# Altium project XMS0004.PrjPcb (part 1 of 3)
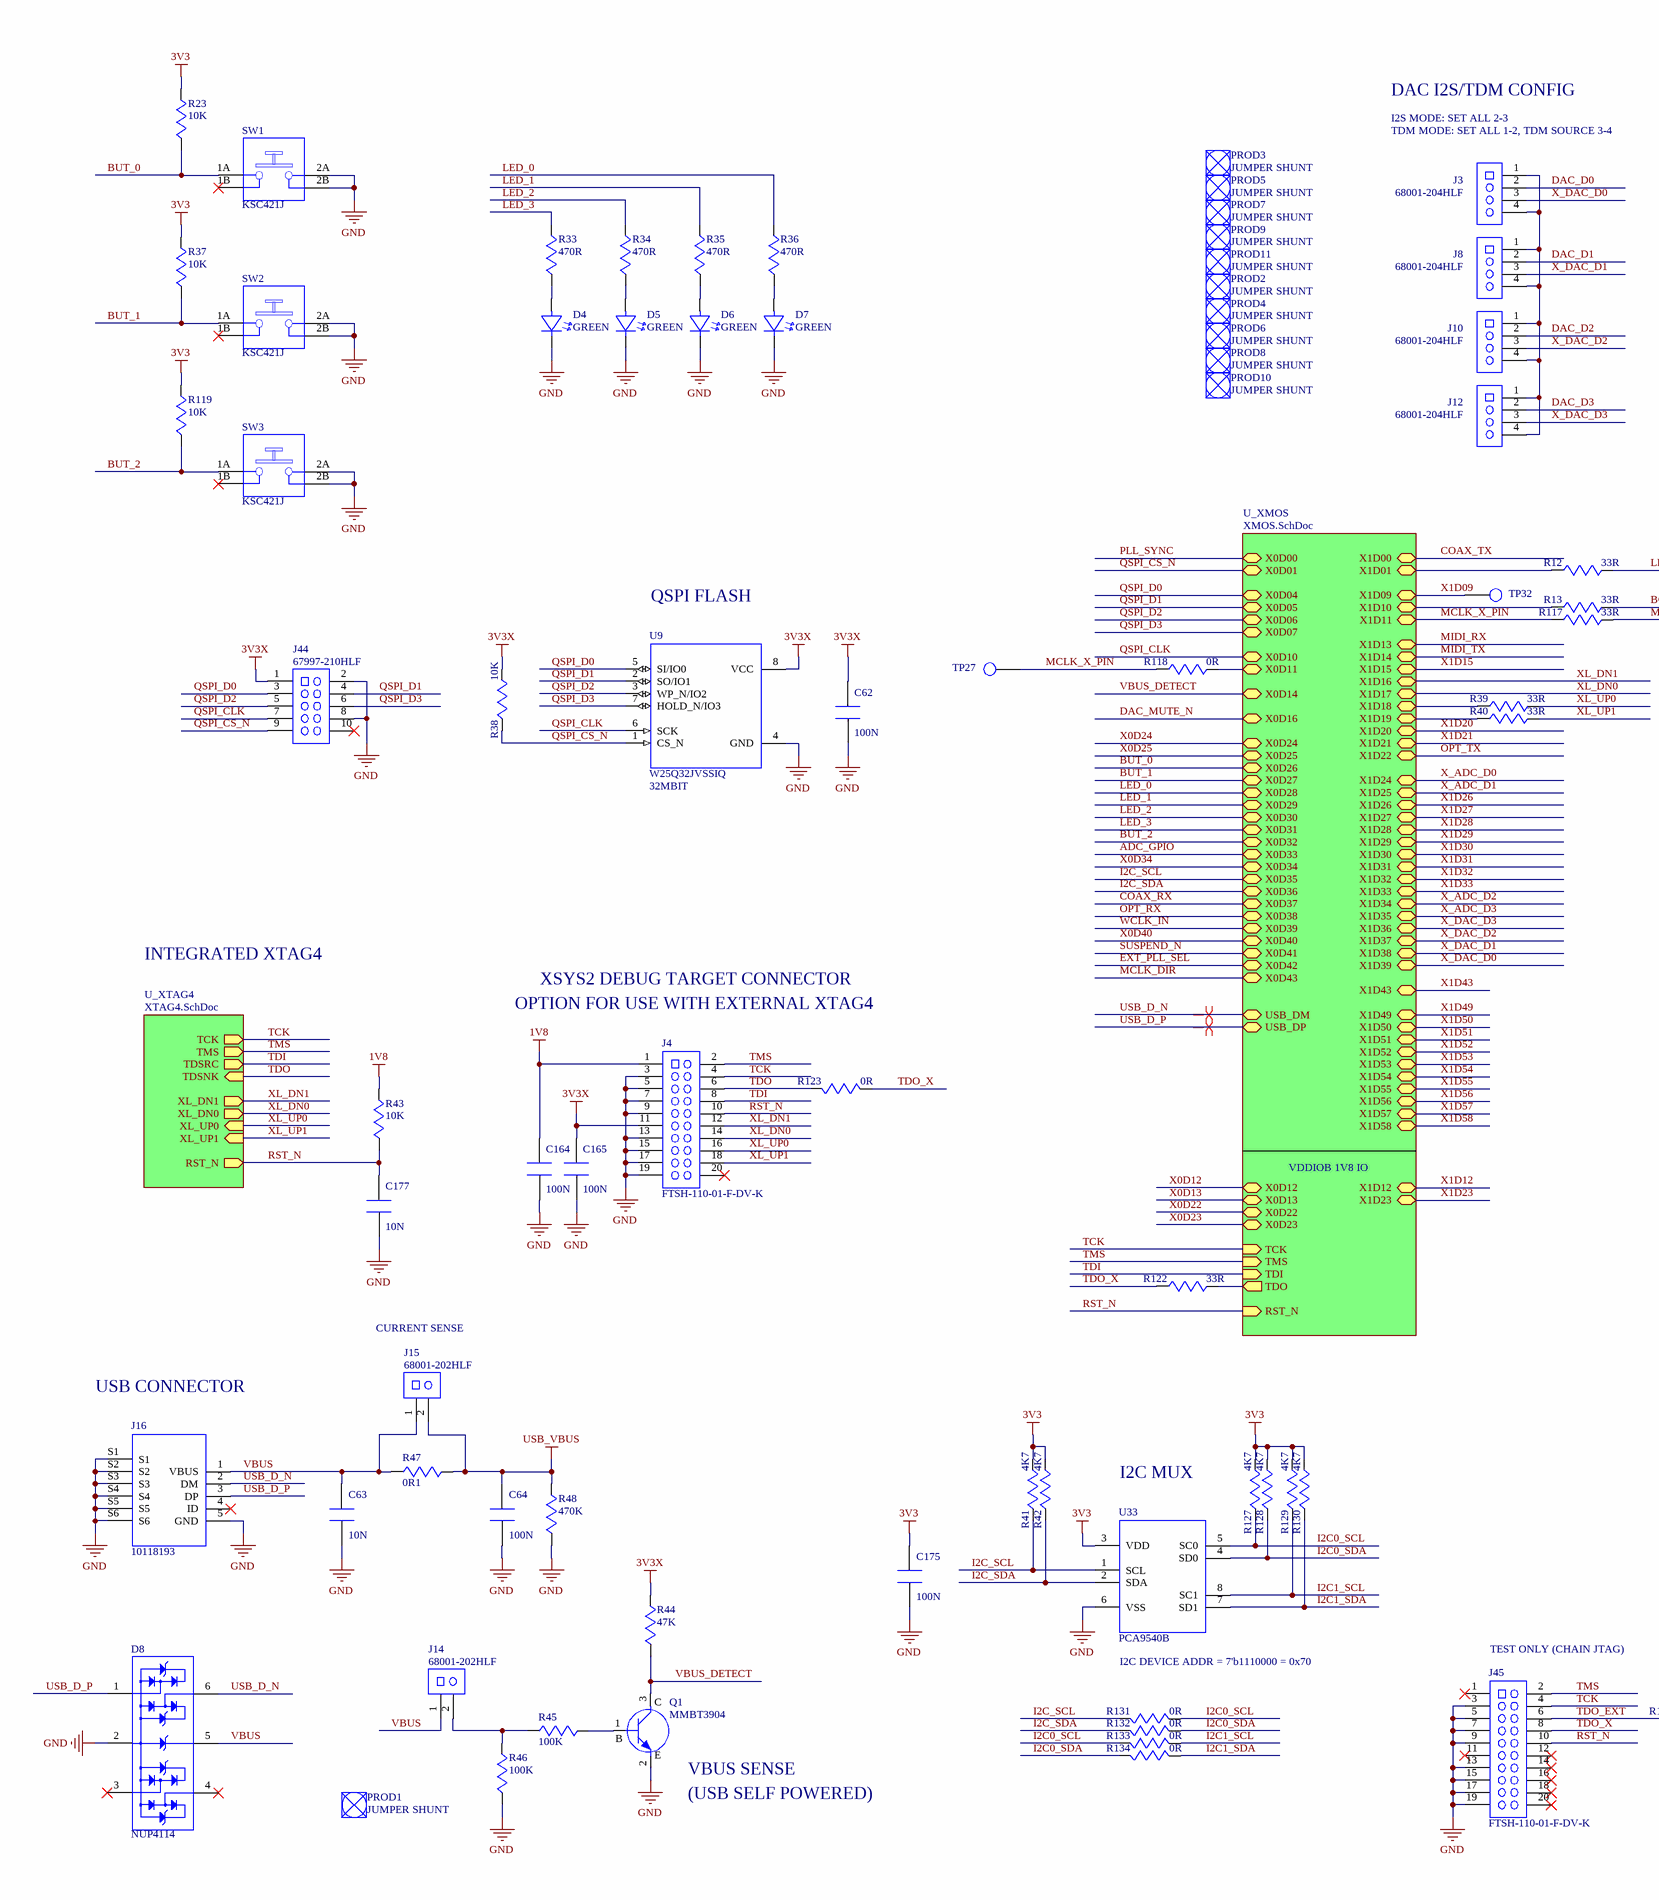
[diagram p0: Top Level.SchDoc, left]
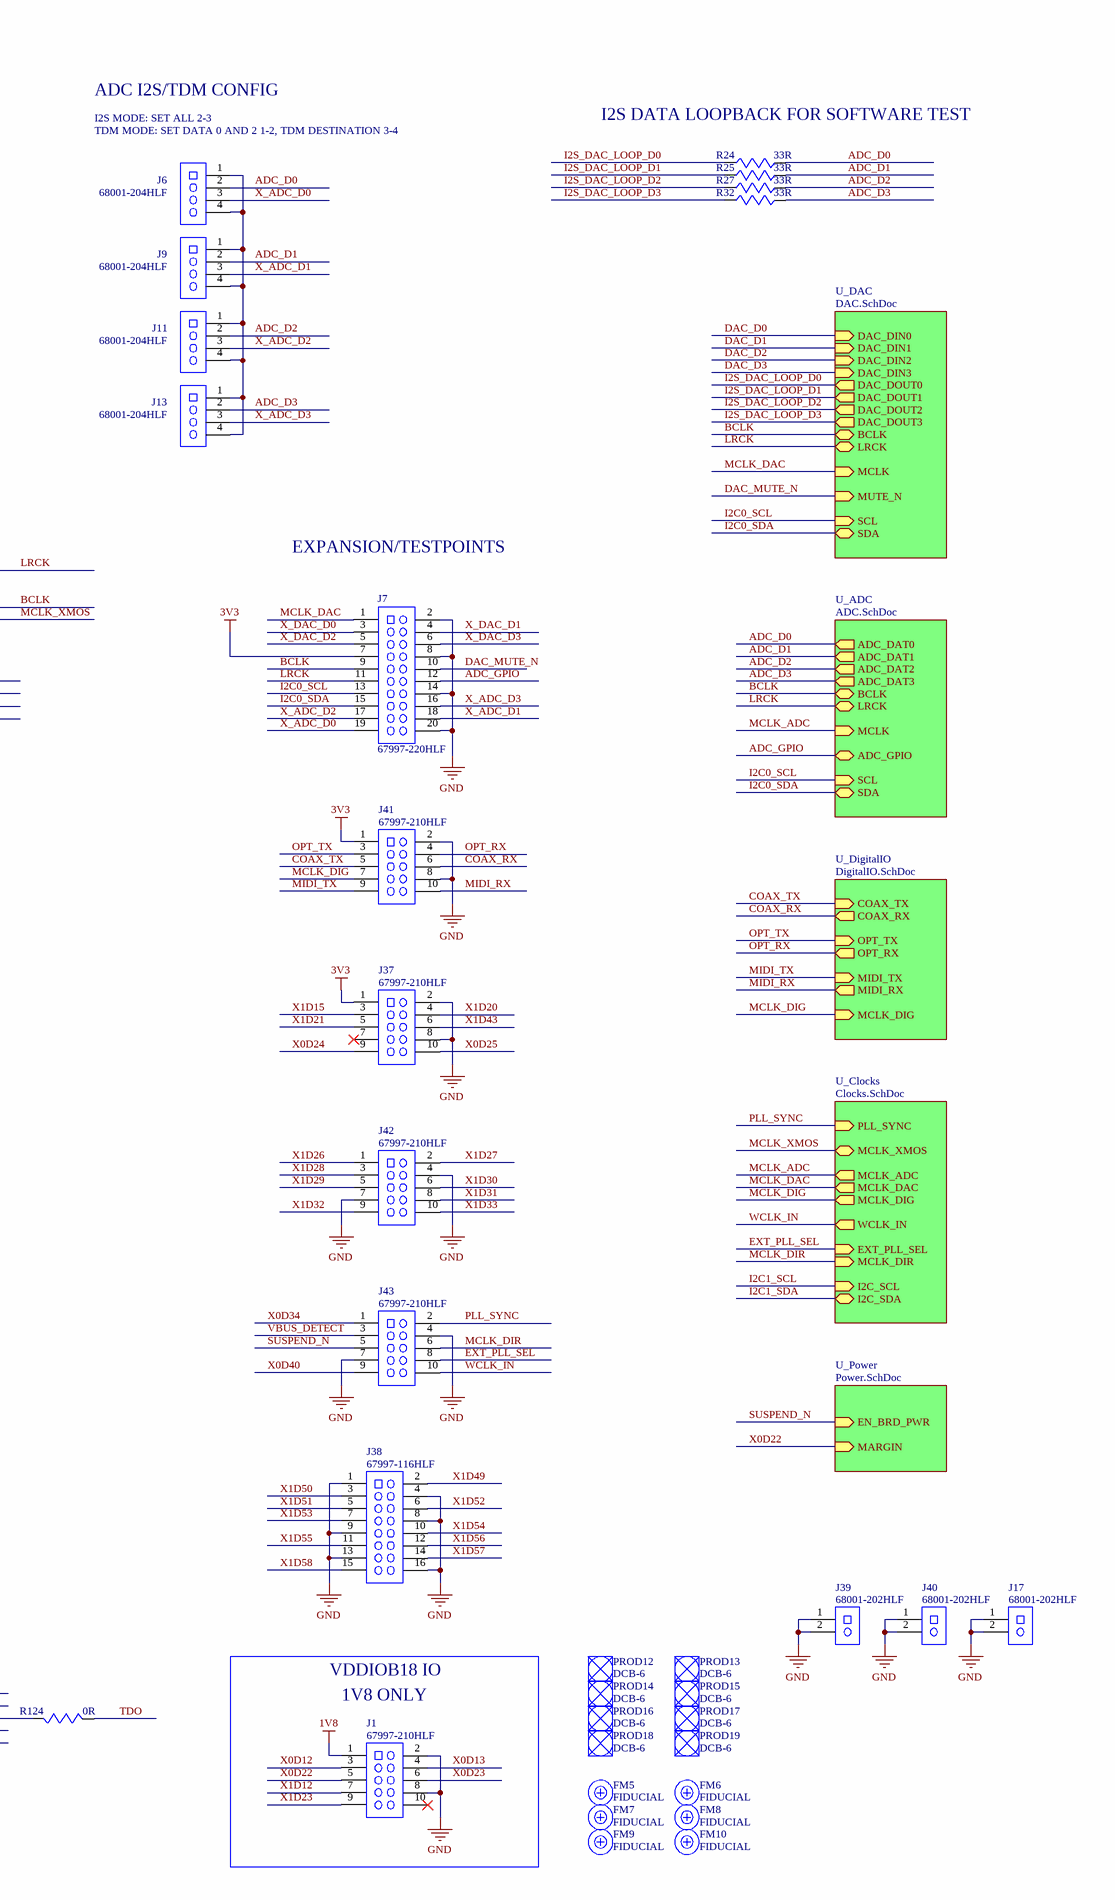
[diagram p1: Top Level.SchDoc, right]
PCB_revision: 1V1
8 sheets, 513 parts. Net scope: hierarchical (ports join the sheet entries above them; power ports are global).
Board file: XMS0004.PcbDoc
Sheets:
  Top Level.SchDoc
    U_XMOS = XMOS.SchDoc
    U_Power = Power.SchDoc
    U_ADC = ADC.SchDoc
    U_DAC = DAC.SchDoc
    U_XTAG4 = XTAG4.SchDoc
    U_DigitalIO = DigitalIO.SchDoc
    U_Clocks = Clocks.SchDoc

## Sheet Top Level.SchDoc: xcore.ai Multi Channel Audio
size 584 x 408 mm; DocumentNumber: 1; Revision: 1V1; SheetNumber: 1; SheetTotal: 8

### Parts
C62  100N  [CAPC1005X55N]
C63  10N  [CAPC1005X55N]
C64  100N  [CAPC1005X55N]
C164  100N  [CAPC1005X55N]
C165  100N  [CAPC1005X55N]
C175  100N  [CAPC1005X55N]
C177  10N  [CAPC1005X55N]
D4  Colour: GREEN  [LEDC1608X85N]  (hidden comment: APT1608)
D5  Colour: GREEN  [LEDC1608X85N]  (hidden comment: APT1608)
D6  Colour: GREEN  [LEDC1608X85N]  (hidden comment: APT1608)
D7  Colour: GREEN  [LEDC1608X85N]  (hidden comment: APT1608)
D8  NUP4114  [SOT65P210X110-6N]
FM5  FIDUCIAL  [FIDUCIAL_10_20]  (no BOM)
FM6  FIDUCIAL  [FIDUCIAL_10_20]  (no BOM)
FM7  FIDUCIAL  [FIDUCIAL_10_20]  (no BOM)
FM8  FIDUCIAL  [FIDUCIAL_10_20]  (no BOM)
FM9  FIDUCIAL  [FIDUCIAL_10_20]  (no BOM)
FM10  FIDUCIAL  [FIDUCIAL_10_20]  (no BOM)
J1  67997-210HLF  [HDR_FCI_67997_X10]
J3  68001-204HLF  [HDR_FCI_68001_204]
J4  FTSH-110-01-F-DV-K  [CON_SAMTEC_FTSH_110_01_X_DV_K]
J6  68001-204HLF  [HDR_FCI_68001_204]
J7  67997-220HLF  [HDR_FCI_67997_220]
J8  68001-204HLF  [HDR_FCI_68001_204]
J9  68001-204HLF  [HDR_FCI_68001_204]
J10  68001-204HLF  [HDR_FCI_68001_204]
J11  68001-204HLF  [HDR_FCI_68001_204]
J12  68001-204HLF  [HDR_FCI_68001_204]
J13  68001-204HLF  [HDR_FCI_68001_204]
J14  68001-202HLF  [HDR_FCI_68001_202]
J15  68001-202HLF  [HDR_FCI_68001_202]
J16  10118193  [CON_FCI_10118193]
J17  68001-202HLF  [HDR_FCI_68001_202]
J37  67997-210HLF  [HDR_FCI_67997_X10]
J38  67997-116HLF  [HDR_FCI_67997_116]
J39  68001-202HLF  [HDR_FCI_68001_202]
J40  68001-202HLF  [HDR_FCI_68001_202]
J41  67997-210HLF  [HDR_FCI_67997_X10]
J42  67997-210HLF  [HDR_FCI_67997_X10]
J43  67997-210HLF  [HDR_FCI_67997_X10]
J44  67997-210HLF  [HDR_FCI_67997_X10]
J45  FTSH-110-01-F-DV-K  [CON_SAMTEC_FTSH_110_01_X_DV_K]
PROD1  JUMPER SHUNT  (mechanical)
PROD2  JUMPER SHUNT  (mechanical)
PROD3  JUMPER SHUNT  (mechanical)
PROD4  JUMPER SHUNT  (mechanical)
PROD5  JUMPER SHUNT  (mechanical)
PROD6  JUMPER SHUNT  (mechanical)
PROD7  JUMPER SHUNT  (mechanical)
PROD8  JUMPER SHUNT  (mechanical)
PROD9  JUMPER SHUNT  (mechanical)
PROD10  JUMPER SHUNT  (mechanical)
PROD11  JUMPER SHUNT  (mechanical)
PROD12  DCB-6  (mechanical)
PROD13  DCB-6  (mechanical)
PROD14  DCB-6  (mechanical)
PROD15  DCB-6  (mechanical)
PROD16  DCB-6  (mechanical)
PROD17  DCB-6  (mechanical)
PROD18  DCB-6  (mechanical)
PROD19  DCB-6  (mechanical)
Q1  MMBT3904  [SOT95P235X115-3N]
R12  33R  [RESC1608X55N]
R13  33R  [RESC1608X55N]
R23  10K  [RESC1608X55N]
R24  33R  [RESC1608X55N]
R25  33R  [RESC1608X55N]
R27  33R  [RESC1608X55N]
R32  33R  [RESC1608X55N]
R33  470R  [RESC1608X55N]
R34  470R  [RESC1608X55N]
R35  470R  [RESC1608X55N]
R36  470R  [RESC1608X55N]
R37  10K  [RESC1608X55N]
R38  10K  [RESC1608X55N]
R39  33R  [RESC1608X55N]
R40  33R  [RESC1608X55N]
R41  4K7  [RESC1608X55N]
R42  4K7  [RESC1608X55N]
R43  10K  [RESC1608X55N]
R44  47K  [RESC1608X55N]
R45  100K  [RESC1608X55N]
R46  100K  [RESC1608X55N]
R47  0R1  [RESC2012X60N]
R48  470K  [RESC1608X55N]
R117  33R  [RESC1608X55N]
R118  0R  [RESC1608X55N]
R119  10K  [RESC1608X55N]
R122  33R  [RESC1608X55N]
R123  0R  [RESC1608X55N]
R124  0R  [RESC1608X55N]
R127  4K7  [RESC1608X55N]
R128  4K7  [RESC1608X55N]
R129  4K7  [RESC1608X55N]
R130  4K7  [RESC1608X55N]
R131  0R  [RESC1608X55N]
R132  0R  [RESC1608X55N]
R133  0R  [RESC1608X55N]
R134  0R  [RESC1608X55N]
SW1  KSC421J  [SW_CK_KSC4_JBEND]
SW2  KSC421J  [SW_CK_KSC4_JBEND]
SW3  KSC421J  [SW_CK_KSC4_JBEND]
TP27  TESTPOINT  [TESTPOINT_SMD_1MM]  (value not drawn)  (no BOM)
TP32  TESTPOINT  [TESTPOINT_SMD_0.9MM_L]  (value not drawn)  (no BOM)
U9  W25Q32JVSSIQ  Memory Size: 32MBIT  [SOIC127P790X220-8N]
U33  PCA9540B  [SOP65P490X110-8N]

### Sub-sheets
U_ADC = ADC.SchDoc: MCLK (in), BCLK (bidir), LRCK (bidir), SCL (in), SDA (bidir), ADC_DAT0 (out), ADC_DAT2 (out), ADC_DAT1 (out), ADC_DAT3 (out), ADC_GPIO (bidir)
U_Clocks = Clocks.SchDoc: PLL_SYNC (in), I2C_SDA (bidir), I2C_SCL (in), MCLK_XMOS (bidir), MCLK_ADC (out), MCLK_DAC (out), WCLK_IN (out), MCLK_DIG (out), EXT_PLL_SEL (in), MCLK_DIR (in)
U_DAC = DAC.SchDoc: MCLK (in), BCLK (bidir), LRCK (bidir), SCL (in), SDA (bidir), DAC_DOUT0 (out), DAC_DIN3 (in), DAC_DIN1 (in), DAC_DIN2 (in), DAC_DIN0 (in), MUTE_N (in), DAC_DOUT1 (out), DAC_DOUT3 (out), DAC_DOUT2 (out)
U_DigitalIO = DigitalIO.SchDoc: MIDI_RX (out), MIDI_TX (in), COAX_TX (in), COAX_RX (out), OPT_RX (out), OPT_TX (in), MCLK_DIG (in)
U_Power = Power.SchDoc: EN_BRD_PWR (in), MARGIN (in)
U_XMOS = XMOS.SchDoc: RST_N (in), TDO (out), TDI (in), TMS (in), TCK (in), X0D10 (bidir), X0D07 (bidir), X0D06 (bidir), X0D05 (bidir), X0D04 (bidir), X0D01 (bidir), USB_DM (bidir), USB_DP (bidir), X1D58 (bidir), X1D57 (bidir), X1D56 (bidir), X1D55 (bidir), X1D54 (bidir), X1D53 (bidir), X1D52 (bidir), X1D51 (bidir), X1D50 (bidir), X1D49 (bidir), X1D22 (bidir), X1D21 (bidir), X1D20 (bidir), X1D19 (bidir), X1D18 (bidir), X1D17 (bidir), X1D16 (bidir), X1D15 (bidir), X1D14 (bidir), X1D13 (bidir), X0D38 (bidir), X0D37 (bidir), X0D36 (bidir), X0D35 (bidir), X0D29 (bidir), X0D28 (bidir), X0D27 (bidir), X0D26 (bidir), X0D25 (bidir), X0D24 (bidir), X1D43 (bidir), X1D35 (bidir), X1D34 (bidir), X1D33 (bidir), X1D32 (bidir), X1D31 (bidir), X1D30 (bidir), X1D29 (bidir), X1D36 (bidir), X1D39 (bidir), X1D11 (bidir), X1D10 (bidir), X0D33 (bidir), X0D32 (bidir), X0D40 (bidir), X0D41 (bidir), X0D42 (bidir), X0D43 (bidir), X1D24 (bidir), X1D25 (bidir), X1D26 (bidir), X1D27 (bidir), X1D28 (bidir), X0D39 (bidir), X1D01 (bidir), X1D09 (bidir), X0D30 (bidir), X0D31 (bidir), X1D37 (bidir), X1D38 (bidir), X0D34 (bidir), X1D00 (bidir), X0D11 (bidir), X0D14 (bidir), X0D16 (bidir), X0D00 (bidir), X0D22 (bidir), X1D12 (bidir), X1D23 (bidir), X0D23 (bidir), X0D13 (bidir), X0D12 (bidir)
U_XTAG4 = XTAG4.SchDoc: RST_N (out), XL_UP0 (in), XL_UP1 (in), XL_DN0 (out), XL_DN1 (out), TMS (out), TCK (out), TDSRC (out), TDSNK (in)

### Nets
1V8: C164.1 J1.1 J4.1 R43.2
3V3: C175.1 J7.7 J37.1 J41.1 R23.2 R37.2 R41.2 R42.2 R119.2 R127.2 R128.2 R129.2 R130.2 U33.3(VDD)
3V3X: C62.1 C165.1 J4.11 J44.1 R38.2 R44.2 U9.8(VCC)
GND: C62.2 C63.2 C64.2 C164.2 C165.2 C175.2 C177.2 D4.1(K) D5.1(K) D6.1(K) D7.1(K) D8.2 J1.2 J1.8 J4.3 J4.5 J4.7 J4.9 J4.13 J4.15 J4.17 J4.19 J7.2 J7.8 J7.14 J7.20 J16.5(GND) J16.S1 J16.S2 J16.S3 J16.S4 J16.S5 J16.S6 J17.1 J17.2 J37.2 J37.8 J38.1 J38.4 J38.8 J38.9 J38.13 J38.16 J39.1 J39.2 J40.1 J40.2 J41.2 J41.8 J42.4 J42.7 J43.4 J43.7 J44.2 J44.8 J45.3 J45.5 J45.7 J45.9 J45.13 J45.15 J45.17 J45.19 Q1.2(E1) R46.1 R48.1 SW1.2A SW1.2B SW2.2A SW2.2B SW3.2A SW3.2B U9.4(GND) U33.6(VSS)
USB_VBUS: C64.1 J15.2 R47.2 R48.2
ADC_D0: J6.2 R24.2 ; sheet U_ADC/ADC_DAT0
ADC_D1: J9.2 R25.2 ; sheet U_ADC/ADC_DAT1
ADC_D2: J11.2 R27.2 ; sheet U_ADC/ADC_DAT2
ADC_D3: J13.2 R32.2 ; sheet U_ADC/ADC_DAT3
ADC_GPIO: J7.12 ; sheet U_XMOS/X0D33, sheet U_ADC/ADC_GPIO
BCLK: J7.9 R13.2 ; sheet U_ADC/BCLK, sheet U_DAC/BCLK
BUT_0: R23.1 SW1.1A ; sheet U_XMOS/X0D26
BUT_1: R37.1 SW2.1A ; sheet U_XMOS/X0D27
BUT_2: R119.1 SW3.1A ; sheet U_XMOS/X0D32
COAX_RX: J41.6 ; sheet U_XMOS/X0D37, sheet U_DigitalIO/COAX_RX
COAX_TX: J41.5 ; sheet U_XMOS/X1D00, sheet U_DigitalIO/COAX_TX
DAC_D0: J3.2 ; sheet U_DAC/DAC_DIN0
DAC_D1: J8.2 ; sheet U_DAC/DAC_DIN1
DAC_D2: J10.2 ; sheet U_DAC/DAC_DIN2
DAC_D3: J12.2 ; sheet U_DAC/DAC_DIN3
DAC_MUTE_N: J7.10 ; sheet U_XMOS/X0D16, sheet U_DAC/MUTE_N
EXT_PLL_SEL: J43.8 ; sheet U_XMOS/X0D42, sheet U_Clocks/EXT_PLL_SEL
I2C0_SCL: J7.13 R127.1 R131.1 R133.2 U33.5(SC0) ; sheet U_ADC/SCL, sheet U_DAC/SCL
I2C0_SDA: J7.15 R128.1 R132.1 R134.2 U33.4(SD0) ; sheet U_ADC/SDA, sheet U_DAC/SDA
I2C1_SCL: R129.1 R133.1 U33.8(SC1) ; sheet U_Clocks/I2C_SCL
I2C1_SDA: R130.1 R134.1 U33.7(SD1) ; sheet U_Clocks/I2C_SDA
I2C_SCL: R41.1 R131.2 U33.1(SCL) ; sheet U_XMOS/X0D35
I2C_SDA: R42.1 R132.2 U33.2(SDA) ; sheet U_XMOS/X0D36
I2S_DAC_LOOP_D0: R24.1 ; sheet U_DAC/DAC_DOUT0
I2S_DAC_LOOP_D1: R25.1 ; sheet U_DAC/DAC_DOUT1
I2S_DAC_LOOP_D2: R27.1 ; sheet U_DAC/DAC_DOUT2
I2S_DAC_LOOP_D3: R32.1 ; sheet U_DAC/DAC_DOUT3
LED_0: R36.2 ; sheet U_XMOS/X0D28
LED_1: R35.2 ; sheet U_XMOS/X0D29
LED_2: R34.2 ; sheet U_XMOS/X0D30
LED_3: R33.2 ; sheet U_XMOS/X0D31
LRCK: J7.11 R12.2 ; sheet U_ADC/LRCK, sheet U_DAC/LRCK
MCLK_ADC: sheet U_ADC/MCLK, sheet U_Clocks/MCLK_ADC
MCLK_DAC: J7.1 ; sheet U_DAC/MCLK, sheet U_Clocks/MCLK_DAC
MCLK_DIG: J41.7 ; sheet U_DigitalIO/MCLK_DIG, sheet U_Clocks/MCLK_DIG
MCLK_DIR: J43.6 ; sheet U_XMOS/X0D43, sheet U_Clocks/MCLK_DIR
MCLK_X_PIN: R117.1 R118.1 TP27.1 ; sheet U_XMOS/X1D11
MCLK_XMOS: R117.2 ; sheet U_Clocks/MCLK_XMOS
MIDI_RX: J41.10 ; sheet U_XMOS/X1D13, sheet U_DigitalIO/MIDI_RX
MIDI_TX: J41.9 ; sheet U_XMOS/X1D14, sheet U_DigitalIO/MIDI_TX
OPT_RX: J41.4 ; sheet U_XMOS/X0D38, sheet U_DigitalIO/OPT_RX
OPT_TX: J41.3 ; sheet U_XMOS/X1D22, sheet U_DigitalIO/OPT_TX
PLL_SYNC: J43.2 ; sheet U_XMOS/X0D00, sheet U_Clocks/PLL_SYNC
QSPI_CLK: J44.7 U9.6(SCK) ; sheet U_XMOS/X0D10
QSPI_CS_N: J44.9 R38.1 U9.1(CS_N) ; sheet U_XMOS/X0D01
QSPI_D0: J44.3 U9.5(SI/IO0) ; sheet U_XMOS/X0D04
QSPI_D1: J44.4 U9.2(SO/IO1) ; sheet U_XMOS/X0D05
QSPI_D2: J44.5 U9.3(WP_N/IO2) ; sheet U_XMOS/X0D06
QSPI_D3: J44.6 U9.7(HOLD_N/IO3) ; sheet U_XMOS/X0D07
RST_N: C177.1 J4.10 J45.10 R43.1 ; sheet U_XMOS/RST_N, sheet U_XTAG4/RST_N
SUSPEND_N: J43.5 ; sheet U_XMOS/X0D41, sheet U_Power/EN_BRD_PWR
TCK: J4.4 J45.4 ; sheet U_XMOS/TCK, sheet U_XTAG4/TCK
TDI: J4.8 ; sheet U_XMOS/TDI, sheet U_XTAG4/TDSRC
TDO: J4.6 R123.2 R124.1 ; sheet U_XTAG4/TDSNK
TDO_EXT: J45.6 R124.2
TDO_X: J45.8 R122.1 R123.1
TMS: J4.2 J45.2 ; sheet U_XMOS/TMS, sheet U_XTAG4/TMS
USB_D_N: D8.6 J16.2(DM) ; sheet U_XMOS/USB_DM
USB_D_P: D8.1 J16.3(DP) ; sheet U_XMOS/USB_DP
VBUS: C63.1 D8.5 J14.1 J15.1 J16.1(VBUS) R47.1
VBUS_DETECT: J43.3 Q1.3(C1) R44.1 ; sheet U_XMOS/X0D14
WCLK_IN: J43.10 ; sheet U_XMOS/X0D39, sheet U_Clocks/WCLK_IN
X0D12: J1.3 ; sheet U_XMOS/X0D12
X0D13: J1.4 ; sheet U_XMOS/X0D13
X0D22: J1.5 ; sheet U_XMOS/X0D22, sheet U_Power/MARGIN
X0D23: J1.6 ; sheet U_XMOS/X0D23
X0D24: J37.9 ; sheet U_XMOS/X0D24
X0D25: J37.10 ; sheet U_XMOS/X0D25
X0D34: J43.1 ; sheet U_XMOS/X0D34
X0D40: J43.9 ; sheet U_XMOS/X0D40
X1D09: TP32.1 ; sheet U_XMOS/X1D09
X1D12: J1.7 ; sheet U_XMOS/X1D12
X1D15: J37.3 ; sheet U_XMOS/X1D15
X1D20: J37.4 ; sheet U_XMOS/X1D20
X1D21: J37.5 ; sheet U_XMOS/X1D21
X1D23: J1.9 ; sheet U_XMOS/X1D23
X1D26: J42.1 ; sheet U_XMOS/X1D26
X1D27: J42.2 ; sheet U_XMOS/X1D27
X1D28: J42.3 ; sheet U_XMOS/X1D28
X1D29: J42.5 ; sheet U_XMOS/X1D29
X1D30: J42.6 ; sheet U_XMOS/X1D30
X1D31: J42.8 ; sheet U_XMOS/X1D31
X1D32: J42.9 ; sheet U_XMOS/X1D32
X1D33: J42.10 ; sheet U_XMOS/X1D33
X1D43: J37.6 ; sheet U_XMOS/X1D43
X1D49: J38.2 ; sheet U_XMOS/X1D49
X1D50: J38.3 ; sheet U_XMOS/X1D50
X1D51: J38.5 ; sheet U_XMOS/X1D51
X1D52: J38.6 ; sheet U_XMOS/X1D52
X1D53: J38.7 ; sheet U_XMOS/X1D53
X1D54: J38.10 ; sheet U_XMOS/X1D54
X1D55: J38.11 ; sheet U_XMOS/X1D55
X1D56: J38.12 ; sheet U_XMOS/X1D56
X1D57: J38.14 ; sheet U_XMOS/X1D57
X1D58: J38.15 ; sheet U_XMOS/X1D58
X_ADC_D0: J6.3 J7.19 ; sheet U_XMOS/X1D24
X_ADC_D1: J7.18 J9.3 ; sheet U_XMOS/X1D25
X_ADC_D2: J7.17 J11.3 ; sheet U_XMOS/X1D34
X_ADC_D3: J7.16 J13.3 ; sheet U_XMOS/X1D35
X_DAC_D0: J3.3 J7.3 ; sheet U_XMOS/X1D39
X_DAC_D1: J7.4 J8.3 ; sheet U_XMOS/X1D38
X_DAC_D2: J7.5 J10.3 ; sheet U_XMOS/X1D37
X_DAC_D3: J7.6 J12.3 ; sheet U_XMOS/X1D36
XL_DN0: J4.14 ; sheet U_XMOS/X1D17, sheet U_XTAG4/XL_DN0
XL_DN1: J4.12 ; sheet U_XMOS/X1D16, sheet U_XTAG4/XL_DN1
XL_UP0: J4.16 R39.2 ; sheet U_XTAG4/XL_UP0
XL_UP1: J4.18 R40.2 ; sheet U_XTAG4/XL_UP1
NetD4_2: D4.2(A) R33.1
NetD5_2: D5.2(A) R34.1
NetD6_2: D6.2(A) R35.1
NetD7_2: D7.2(A) R36.1
NetJ3_1: J3.1 J3.4 J8.1 J8.4 J10.1 J10.4 J12.1 J12.4
NetJ6_1: J6.1 J6.4 J9.1 J9.4 J11.1 J11.4 J13.1 J13.4
NetJ14_2: J14.2 R45.1 R46.2
NetQ1_1: Q1.1(B1) R45.2
NetR12_1: R12.1 ; sheet U_XMOS/X1D01
NetR13_1: R13.1 ; sheet U_XMOS/X1D10
NetR39_1: R39.1 ; sheet U_XMOS/X1D18
NetR40_1: R40.1 ; sheet U_XMOS/X1D19
NetR118_2: R118.2 ; sheet U_XMOS/X0D11
NetR122_2: R122.2 ; sheet U_XMOS/TDO

Not connected (* = marked no-connect by the designer): D8 3* 4*; J1 10*; J4 20*; J16 4(ID)*; J37 7*; J44 10*; J45 1* 11* 12* 14* 16* 18* 20*; SW1 1B*; SW2 1B*; SW3 1B*

### Layout directives
differential pair; differential pair class USB: USB_D_N, USB_D_P

### Notes on the sheet
- I2S MODE: SET ALL 2-3
- DAC I2S/TDM CONFIG
- ADC I2S/TDM CONFIG
- I2S DATA LOOPBACK FOR SOFTWARE TEST
- (near J3) TDM MODE: SET ALL 1-2, TDM SOURCE 3-4
- (near J6) TDM MODE: SET DATA 0 AND 2 1-2, TDM DESTINATION 3-4
- EXPANSION/TESTPOINTS
- QSPI FLASH
- INTEGRATED XTAG4
- XSYS2 DEBUG TARGET CONNECTOR
- OPTION FOR USE WITH EXTERNAL XTAG4
- VDDIOB 1V8 IO
- CURRENT SENSE
- USB CONNECTOR
- I2C MUX
- I2C DEVICE ADDR = 7'b1110000 = 0x70
- (near J45) TEST ONLY (CHAIN JTAG)
- VDDIOB18 IO
- 1V8 ONLY
- (near Q1) VBUS SENSE
- (near Q1) (USB SELF POWERED)
- Project Name
- Build
- Sheet Name
- Rev
- Date
- Sheet
- of
- (in symbol GEN-16-0051) C; B; E

### Library data of the parts
C62 C64 C164 C165 C175 = STD-06-0048: CHIP CAPACITOR, CERAMIC, 100NF, 16V, 10%, X7R, 0402; Manufacturer: Yageo; Manufacturer Part Number: CC0402KRX7R7BB104; Approx Volume Cost ($): 0.003; VALUE: 100N; Part Number: STD-06-0048; Dielectric: X7R; Rated Voltage: 16V; Tolerance: 10%
  C62 C64 C175: Web Search Link: http://www.google.com/search?q=CC0402KRX7R7BB104
C63 C177 = STD-06-0042: CHIP CAPACITOR, CERAMIC, 10NF, 50V, 10%, X7R, 0402; Manufacturer: Yageo; Manufacturer Part Number: CC0402KRX7R9BB103; Approx Volume Cost ($): 0.002; VALUE: 10N; Part Number: STD-06-0042; Dielectric: X7R; Rated Voltage: 50V; Tolerance: 10%; Web Search Link: http://www.google.com/search?q=CC0402KRX7R9BB103
D4-D7 = GEN-17-0001: LED, GREEN, 0603; Manufacturer: Kingbright; Manufacturer Part Number: APT1608CGCK; Approx Volume Cost ($): 0.05; VALUE: APT1608; Part Number: GEN-17-0001; Web Search Link: http://www.google.com/search?q=APT1608CGCK
D8 = GEN-16-0048: ESD Protection Diode Array, 0.6pF, SC-70-6 (SC-88); Manufacturer: ON Semiconductor; Manufacturer Part Number: NUP4114UCLW1T2G; Approx Volume Cost ($): 0.1; VALUE: NUP4114; Part Number: GEN-16-0048; Web Search Link: http://www.google.com/search?q=NUP4114UCLW1T2G
FM5-FM10 = GEN-24-0001: Fiducial, Circle, 1mm Pad, 2mm Keepout; Manufacturer: NA; VALUE: FIDUCIAL; Part Number: GEN-24-0001; Manufacturer Part Number: NA; Approx Volume Cost ($): NA
J1 J37 J41-J44 = GEN-01-0029: Pin Header, Male, Vertical, Through Hole, 10 Way, 2x5, 0.1 Inch Pitch; Manufacturer: FCI; Approx Volume Cost ($): 0.2; VALUE: 67997-210HLF; Part Number: GEN-01-0029; Manufacturer Part Number: 67997-210HLF; Web Search Link: http://www.google.com/search?q=67997-210HLF
J3 J6 J8-J13 = GEN-01-0125: Pin Header, Male, Vertical, Through Hole, 4 Way, 1x4, 0.1 Inch Pitch; Manufacturer: FCI; Approx Volume Cost ($): 0.18; VALUE: 68001-204HLF; Part Number: GEN-01-0125; Manufacturer Part Number: 68001-204HLF; Web Search Link: http://www.google.com/search?q=68001-204HLF
J4 J45 = GEN-01-0126: Pin Header, Male, Vertical, 20 Way, 2x10, 1.27mm Pitch, Keying Shroud, SMD; Manufacturer: Samtec; Approx Volume Cost ($): 3.7; VALUE: FTSH-110-01-F-DV-K; Part Number: GEN-01-0126; Manufacturer Part Number: FTSH-110-01-F-DV-K; Web Search Link: http://www.google.com/search?q=FTSH-110-01-F-DV-K
J7 = GEN-01-0070: Pin Header, Male, Vertical, Through Hole, 20 Way, 2x10, 0.1 Inch Pitch; Manufacturer: FCI; Approx Volume Cost ($): 0.73; VALUE: 67997-220HLF; Part Number: GEN-01-0070; Manufacturer Part Number: 67997-220HLF; Web Search Link: http://www.google.com/search?q=67997-220HLF
J14 J15 J17 J39 J40 = GEN-01-0011: Pin Header, Male, Vertical, Through Hole, 2 Way, 1x2, 0.1 Inch Pitch; Manufacturer: FCI; Approx Volume Cost ($): 0.08; VALUE: 68001-202HLF; Part Number: GEN-01-0011; Manufacturer Part Number: 68001-202HLF
  J14 J15 J39 J40: Web Search Link: http://www.google.com/search?q=68001-202HLF
J16 = GEN-01-0020: USB Micro B Receptacle, Right Angle, SMD w/2 DIP Legs; Manufacturer: FCI; Manufacturer Part Number: 10118193-0001LF; Approx Volume Cost ($): 0.19; VALUE: 10118193; Part Number: GEN-01-0020; Web Search Link: http://www.google.com/search?q=10118193-0001LF
J38 = GEN-01-0019: Pin Header, Male, Through Hole, 16 Way, 2x8, 0.76u Gold, 0.1 Inch Pitch; Manufacturer: FCI; Approx Volume Cost ($): 0.29; VALUE: 67997-116HLF; Part Number: GEN-01-0019; Manufacturer Part Number: 67997-116HLF
PROD1-PROD11 = GEN-23-0011: Jumper Shunt, Single Circuit, Open Type, 2.54mm Pitch, 6mm High, Gold Flash; Manufacturer: Sullins; Manufacturer Part Number: QPC02SXGN-RC; Approx Volume Cost ($): 0.03; VALUE: JUMPER SHUNT; Part Number: GEN-23-0011; Web Search Link: http://www.google.com/search?q=QPC02SXGN-RC
PROD12-PROD19 = GEN-23-0002: Snap-in PCB Spacer Support, 6mm; Manufacturer: KANG YANG (Toby Electronics); Approx Volume Cost ($): 0.01; VALUE: DCB-6; Part Number: GEN-23-0002; Manufacturer Part Number: DCB-6; Web Search Link: http://www.google.com/search?q=DCB-6
Q1 = GEN-16-0051: BJT Transistor, NPN, 40V, 200mA, SOT23; Manufacturer: Nexperia; Manufacturer Part Number: MMBT3904,215; Approx Volume Cost ($): 0.02; VALUE: MMBT3904; Part Number: GEN-16-0051; Web Search Link: http://www.google.com/search?q=MMBT3904,215
R12 R13 R24 R25 R27 R32 R39 R40 R117 R122 = STD-02-0026: CHIP RESISTOR, 33 OHM, 0.1W, 1%, 0603; Manufacturer: Yageo; Manufacturer Part Number: RC0603FR-0733RL; Max Voltage: 50V; Max Power: 100mW; Temperature Coefficient: ±100ppm/°C; Approx Volume Cost ($): 0.002; VALUE: 33R; Part Number: STD-02-0026; Tolerance: 1%; Web Search Link: http://www.google.com/search?q=RC0603FR-0733RL
R23 R37 R38 R43 R119 = STD-02-0086: CHIP RESISTOR, 10K OHM, 0.1W, 1%, 0603; Manufacturer: Yageo; Manufacturer Part Number: RC0603FR-0710KL; Max Voltage: 50V; Max Power: 100mW; Temperature Coefficient: ±100ppm/°C; Approx Volume Cost ($): 0.002; VALUE: 10K; Part Number: STD-02-0086; Tolerance: 1%; Web Search Link: http://www.google.com/search?q=RC0603FR-0710KL
R33-R36 = STD-02-0054: CHIP RESISTOR, 470 OHM, 0.1W, 1%, 0603; Manufacturer: Yageo; Manufacturer Part Number: RC0603FR-07470RL; Max Voltage: 50V; Max Power: 100mW; Temperature Coefficient: ±100ppm/°C; Approx Volume Cost ($): 0.002; VALUE: 470R; Part Number: STD-02-0054; Tolerance: 1%; Web Search Link: http://www.google.com/search?q=RC0603FR-07470RL
R41 R42 R127-R130 = STD-02-0078: CHIP RESISTOR, 4.7K OHM, 0.1W, 1%, 0603; Manufacturer: Yageo; Manufacturer Part Number: RC0603FR-074K7L; Max Voltage: 50V; Max Power: 100mW; Temperature Coefficient: ±100ppm/°C; Approx Volume Cost ($): 0.002; VALUE: 4K7; Part Number: STD-02-0078; Tolerance: 1%; Web Search Link: http://www.google.com/search?q=RC0603FR-074K7L
R44 = STD-02-0102: CHIP RESISTOR, 47K OHM, 0.1W, 1%, 0603; Manufacturer: Yageo; Manufacturer Part Number: RC0603FR-0747KL; Max Voltage: 50V; Max Power: 100mW; Temperature Coefficient: ±100ppm/°C; Approx Volume Cost ($): 0.002; VALUE: 47K; Part Number: STD-02-0102; Tolerance: 1%; Web Search Link: http://www.google.com/search?q=RC0603FR-0747KL
R45 R46 = STD-02-0110: CHIP RESISTOR, 100K OHM, 0.1W, 1%, 0603; Manufacturer: Yageo; Manufacturer Part Number: RC0603FR-07100KL; Max Voltage: 50V; Max Power: 100mW; Temperature Coefficient: ±100ppm/°C; Approx Volume Cost ($): 0.002; VALUE: 100K; Part Number: STD-02-0110; Tolerance: 1%; Web Search Link: http://www.google.com/search?q=RC0603FR-07100KL
R47 = GEN-02-0029: CHIP RESISTOR, 0.1 OHM, 250mW, 1%, 0805; Manufacturer: Yageo; Manufacturer Part Number: RL0805FR-7W0R1L; Max Voltage: 50V; Max Power: 0.25W; Temperature Coefficient: ±600ppm/°C; Approx Volume Cost ($): 0.06; VALUE: 0R1; Part Number: GEN-02-0029; Tolerance: 1%; Web Search Link: http://www.google.com/search?q=RL0805FR-7W0R1L
R48 = STD-02-0126: CHIP RESISTOR, 470K OHM, 0.1W, 1%, 0603; Manufacturer: Yageo; Manufacturer Part Number: RC0603FR-07470KL; Max Voltage: 50V; Max Power: 100mW; Temperature Coefficient: ±100ppm/°C; Approx Volume Cost ($): 0.002; VALUE: 470K; Part Number: STD-02-0126; Tolerance: 1%; Web Search Link: http://www.google.com/search?q=RC0603FR-07470KL
R118 R123 R124 R131-R134 = STD-02-0001: CHIP RESISTOR, ZERO OHM JUMPER, 1A, 0603; Manufacturer: Yageo; Manufacturer Part Number: RC0603JR-070RL; Tolerance: NA; Max Voltage: 50V; Approx Volume Cost ($): 0.002; VALUE: 0R; Part Number: STD-02-0001; Max Power: NA; Temperature Coefficient: NA; Web Search Link: http://www.google.com/search?q=RC0603JR-070RL
SW1-SW3 = GEN-20-0004: Tactile Switch, Momentary, J Bend SMD; Manufacturer: C&K; Manufacturer Part Number: KSC421J 70SH LFS; Approx Volume Cost ($): 0.27; VALUE: KSC421J; Part Number: GEN-20-0004; Web Search Link: http://www.google.com/search?q=KSC421J 70SH LFS
TP27 = GEN-24-0003: Testpoint, SMD, 1mm; Manufacturer: NA; VALUE: TESTPOINT; Part Number: GEN-24-0003; Manufacturer Part Number: NA; Approx Volume Cost ($): NA
TP32 = GEN-24-0019: Testpoint, SMD, 0.9mm; Manufacturer: NA; VALUE: TESTPOINT; Part Number: GEN-24-0019; Manufacturer Part Number: NA; Approx Volume Cost ($): NA
U9 = GEN-12-0035: Memory, Flash, SPI, Multi-IO, 32Mb (16Kx256), 2.7 to 3.6V, QE = 1, SOIC-8-W; Manufacturer: Winbond; Approx Volume Cost ($): 0.61; VALUE: W25Q32JVSSIQ; Part Number: GEN-12-0035; Manufacturer Part Number: W25Q32JVSSIQ; Web Search Link: http://www.google.com/search?q=W25Q32JVSSIQ
U33 = GEN-09-0030: 2-channel I2C-bus multiplexer, TSSOP8; Manufacturer: NXP; Manufacturer Part Number: PCA9540BDP,118; Approx Volume Cost ($): 1.64; VALUE: PCA9540B; Part Number: GEN-09-0030; Web Search Link: http://www.google.com/search?q=PCA9540BDP,118

## Sheet XMOS.SchDoc: xcore.ai Multi Channel Audio
size 408 x 287 mm; DocumentNumber: 2; Revision: 1V1; SheetNumber: 2; SheetTotal: 8
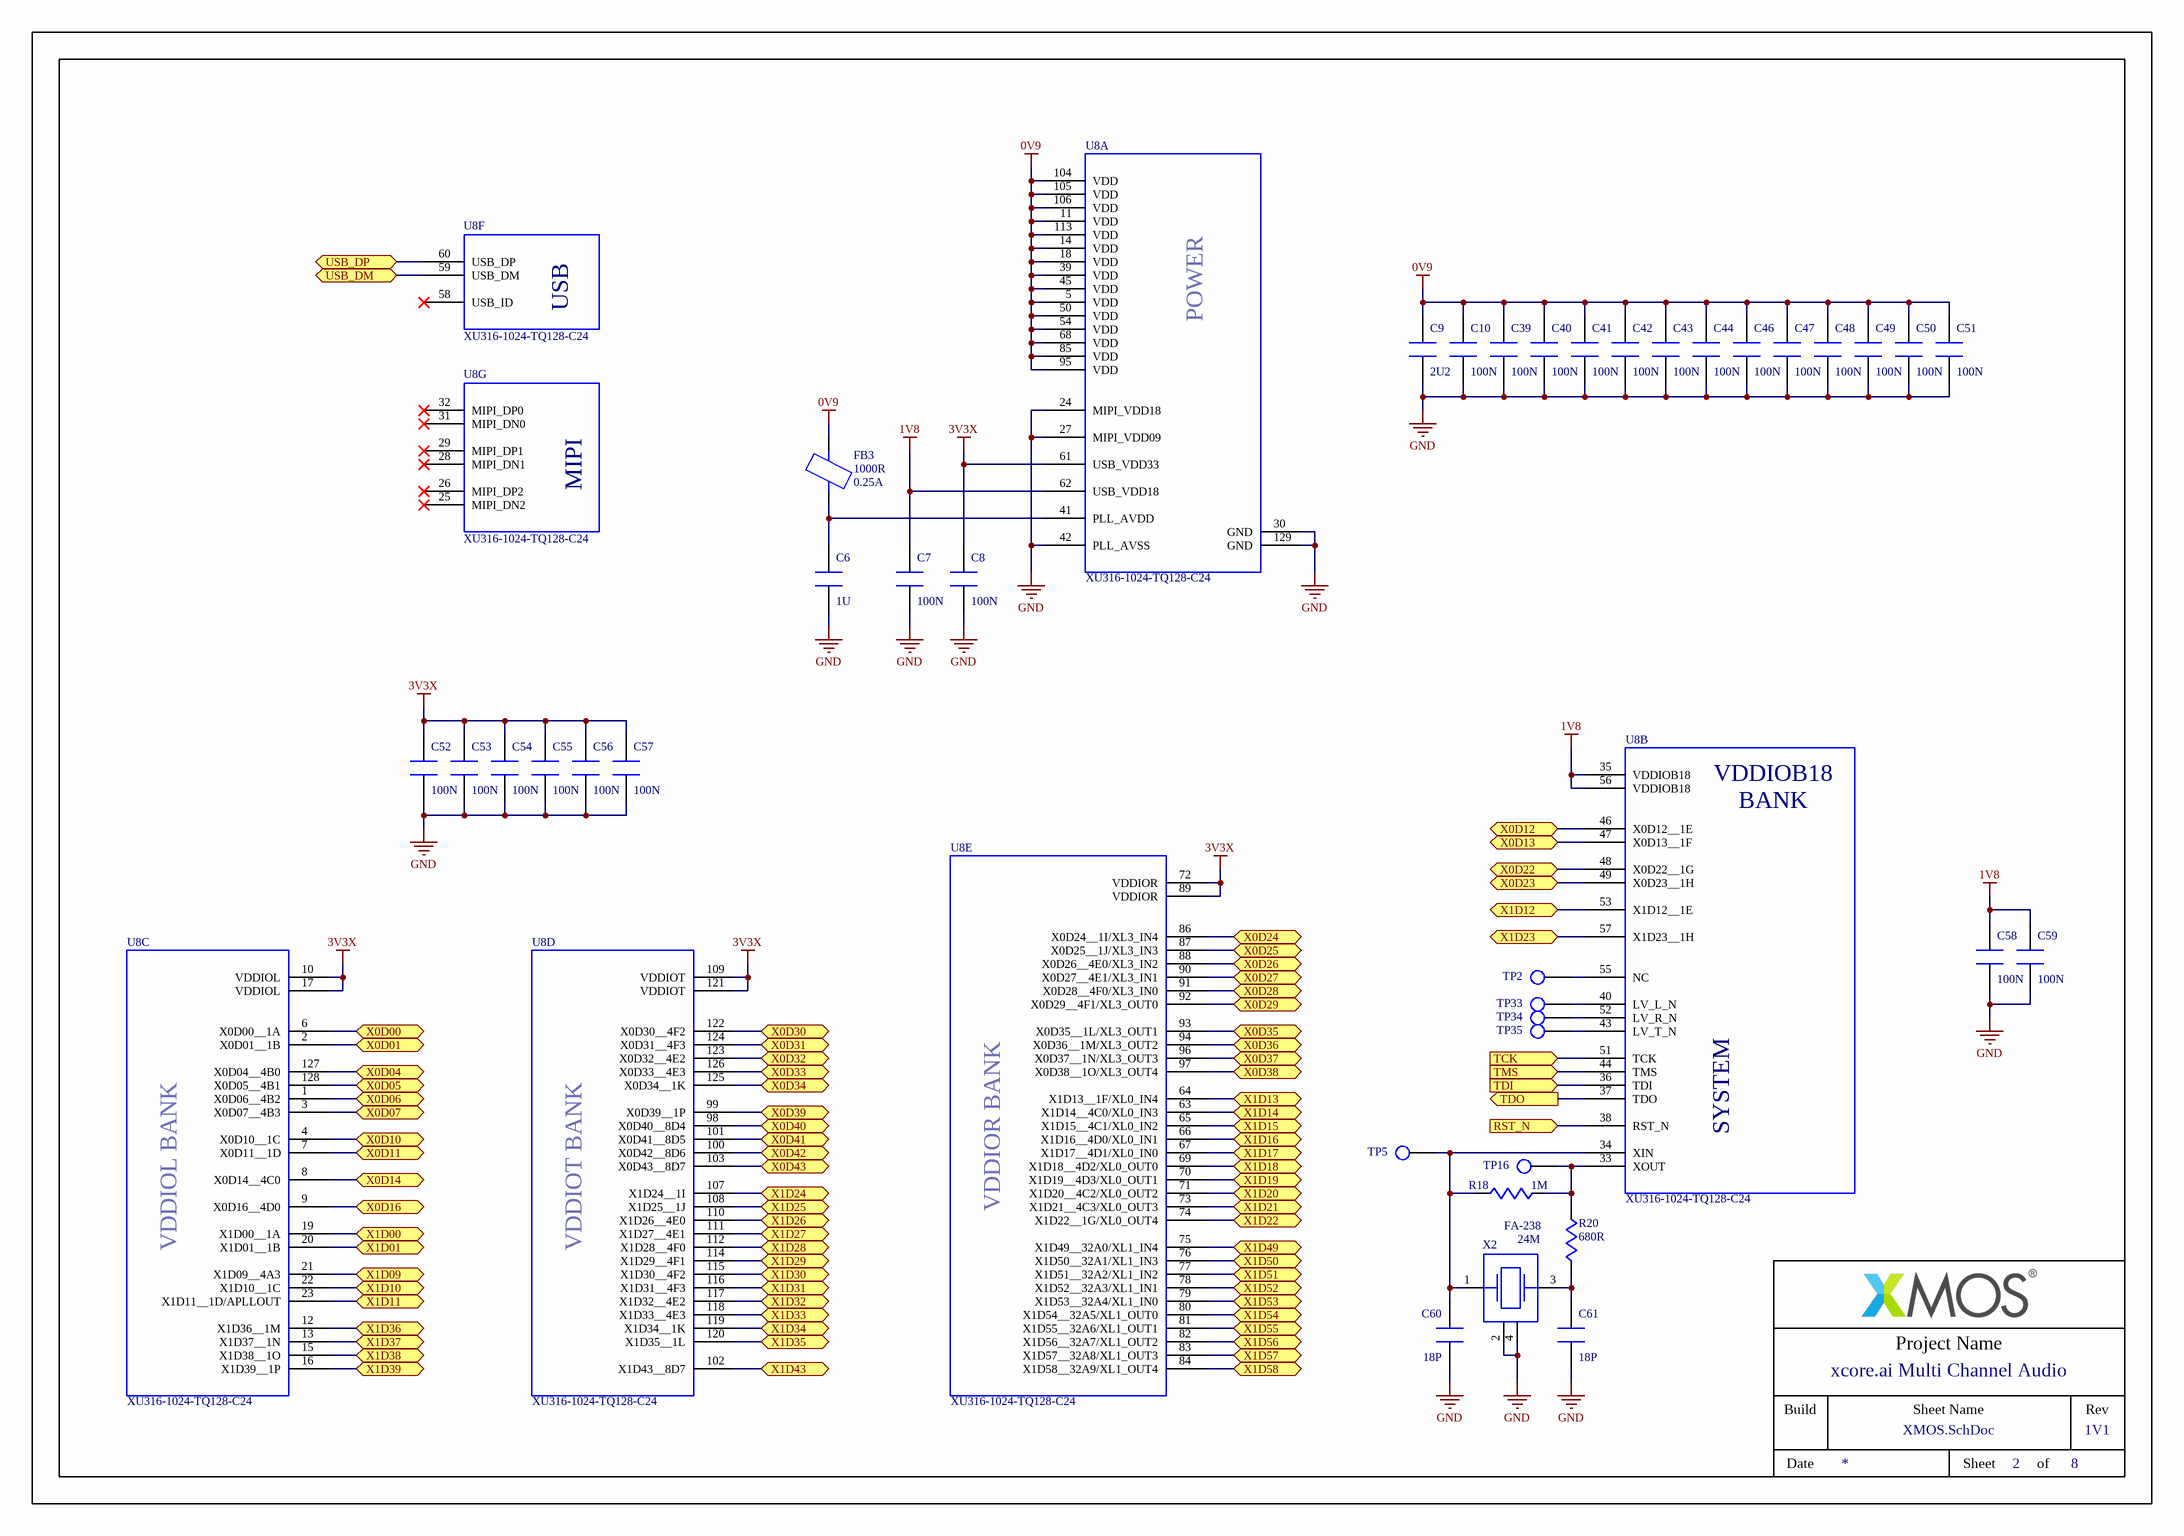
[diagram p2: XMOS.SchDoc]

### Parts
C6  1U  [CAPC1005X55N]
C7  100N  [CAPC1005X55N]
C8  100N  [CAPC1005X55N]
C9  2U2  [CAPC1005X55N]
C10  100N  [CAPC1005X55N]
C39  100N  [CAPC1005X55N]
C40  100N  [CAPC1005X55N]
C41  100N  [CAPC1005X55N]
C42  100N  [CAPC1005X55N]
C43  100N  [CAPC1005X55N]
C44  100N  [CAPC1005X55N]
C46  100N  [CAPC1005X55N]
C47  100N  [CAPC1005X55N]
C48  100N  [CAPC1005X55N]
C49  100N  [CAPC1005X55N]
C50  100N  [CAPC1005X55N]
C51  100N  [CAPC1005X55N]
C52  100N  [CAPC1005X55N]
C53  100N  [CAPC1005X55N]
C54  100N  [CAPC1005X55N]
C55  100N  [CAPC1005X55N]
C56  100N  [CAPC1005X55N]
C57  100N  [CAPC1005X55N]
C58  100N  [CAPC1005X55N]
C59  100N  [CAPC1005X55N]
C60  18P  [CAPC1005X55N]
C61  18P  [CAPC1005X55N]
FB3  1000R  Rated Current: 0.25A  [INDC1005X55N]
R18  1M  [RESC1608X55N]
R20  680R  [RESC1608X55N]
TP2  TESTPOINT  [TESTPOINT_SMD_0.9MM_L]  (value not drawn)  (no BOM)
TP5  TESTPOINT  [TESTPOINT_SMD_0.9MM_L]  (value not drawn)  (no BOM)
TP16  TESTPOINT  [TESTPOINT_SMD_0.9MM_L]  (value not drawn)  (no BOM)
TP33  TESTPOINT  [TESTPOINT_SMD_0.9MM_L]  (value not drawn)  (no BOM)
TP34  TESTPOINT  [TESTPOINT_SMD_0.9MM_L]  (value not drawn)  (no BOM)
TP35  TESTPOINT  [TESTPOINT_SMD_0.9MM_L]  (value not drawn)  (no BOM)
U8  XU316-1024-TQ128-C24  [QFP40P1600X1600X120-129_T480N]  (parts A,B,C,D,E,F,G of 7)
X2  FA-238  FREQUENCY: 24M  [OSCCC320X250X120N]

### Ports
RST_N (in), TCK (in), TDI (in), TDO (out), TMS (in), USB_DM (bidir), USB_DP (bidir), X0D00 (bidir), X0D01 (bidir), X0D04 (bidir), X0D05 (bidir), X0D06 (bidir), X0D07 (bidir), X0D10 (bidir), X0D11 (bidir), X0D12 (bidir), X0D13 (bidir), X0D14 (bidir), X0D16 (bidir), X0D22 (bidir), X0D23 (bidir), X0D24 (bidir), X0D25 (bidir), X0D26 (bidir), X0D27 (bidir), X0D28 (bidir), X0D29 (bidir), X0D30 (bidir), X0D31 (bidir), X0D32 (bidir), X0D33 (bidir), X0D34 (bidir), X0D35 (bidir), X0D36 (bidir), X0D37 (bidir), X0D38 (bidir), X0D39 (bidir), X0D40 (bidir), X0D41 (bidir), X0D42 (bidir), X0D43 (bidir), X1D00 (bidir), X1D01 (bidir), X1D09 (bidir), X1D10 (bidir), X1D11 (bidir), X1D12 (bidir), X1D13 (bidir), X1D14 (bidir), X1D15 (bidir), X1D16 (bidir), X1D17 (bidir), X1D18 (bidir), X1D19 (bidir), X1D20 (bidir), X1D21 (bidir), X1D22 (bidir), X1D23 (bidir), X1D24 (bidir), X1D25 (bidir), X1D26 (bidir), X1D27 (bidir), X1D28 (bidir), X1D29 (bidir), X1D30 (bidir), X1D31 (bidir), X1D32 (bidir), X1D33 (bidir), X1D34 (bidir), X1D35 (bidir), X1D36 (bidir), X1D37 (bidir), X1D38 (bidir), X1D39 (bidir), X1D43 (bidir), X1D49 (bidir), X1D50 (bidir), X1D51 (bidir), X1D52 (bidir), X1D53 (bidir), X1D54 (bidir), X1D55 (bidir), X1D56 (bidir), X1D57 (bidir), X1D58 (bidir)

### Nets
0V9: C9.1 C10.1 C39.1 C40.1 C41.1 C42.1 C43.1 C44.1 C46.1 C47.1 C48.1 C49.1 C50.1 C51.1 FB3.2 U8.5(VDD) U8.11(VDD) U8.14(VDD) U8.18(VDD) U8.39(VDD) U8.45(VDD) U8.50(VDD) U8.54(VDD) U8.68(VDD) U8.85(VDD) U8.95(VDD) U8.104(VDD) U8.105(VDD) U8.106(VDD) U8.113(VDD)
1V8: C7.1 C58.1 C59.1 U8.35(VDDIOB18) U8.56(VDDIOB18) U8.62(USB_VDD18)
3V3X: C8.1 C52.1 C53.1 C54.1 C55.1 C56.1 C57.1 U8.10(VDDIOL) U8.17(VDDIOL) U8.61(USB_VDD33) U8.72(VDDIOR) U8.89(VDDIOR) U8.109(VDDIOT) U8.121(VDDIOT)
GND: C6.2 C7.2 C8.2 C9.2 C10.2 C39.2 C40.2 C41.2 C42.2 C43.2 C44.2 C46.2 C47.2 C48.2 C49.2 C50.2 C51.2 C52.2 C53.2 C54.2 C55.2 C56.2 C57.2 C58.2 C59.2 C60.2 C61.2 U8.24(MIPI_VDD18) U8.27(MIPI_VDD09) U8.30(GND) U8.42(PLL_AVSS) U8.129(GND) X2.2(CASE_2) X2.4(CASE_4)
ADC_GPIO: U8.126(X0D33__4E3) ; port X0D33
BUT_0: U8.88(X0D26__4E0/XL3_IN2) ; port X0D26
BUT_1: U8.90(X0D27__4E1/XL3_IN1) ; port X0D27
BUT_2: U8.123(X0D32__4E2) ; port X0D32
COAX_RX: U8.96(X0D37__1N/XL3_OUT3) ; port X0D37
COAX_TX: U8.19(X1D00__1A) ; port X1D00
DAC_MUTE_N: U8.9(X0D16__4D0) ; port X0D16
EXT_PLL_SEL: U8.100(X0D42__8D6) ; port X0D42
I2C_SCL: U8.93(X0D35__1L/XL3_OUT1) ; port X0D35
I2C_SDA: U8.94(X0D36__1M/XL3_OUT2) ; port X0D36
LED_0: U8.91(X0D28__4F0/XL3_IN0) ; port X0D28
LED_1: U8.92(X0D29__4F1/XL3_OUT0) ; port X0D29
LED_2: U8.122(X0D30__4F2) ; port X0D30
LED_3: U8.124(X0D31__4F3) ; port X0D31
MCLK_DIR: U8.103(X0D43__8D7) ; port X0D43
MCLK_X_PIN: U8.23(X1D11__1D/APLLOUT) ; port X1D11
MIDI_RX: U8.64(X1D13__1F/XL0_IN4) ; port X1D13
MIDI_TX: U8.63(X1D14__4C0/XL0_IN3) ; port X1D14
OPT_RX: U8.97(X0D38__1O/XL3_OUT4) ; port X0D38
OPT_TX: U8.74(X1D22__1G/XL0_OUT4) ; port X1D22
PLL_SYNC: U8.6(X0D00__1A) ; port X0D00
QSPI_CLK: U8.4(X0D10__1C) ; port X0D10
QSPI_CS_N: U8.2(X0D01__1B) ; port X0D01
QSPI_D0: U8.127(X0D04__4B0) ; port X0D04
QSPI_D1: U8.128(X0D05__4B1) ; port X0D05
QSPI_D2: U8.1(X0D06__4B2) ; port X0D06
QSPI_D3: U8.3(X0D07__4B3) ; port X0D07
RST_N: U8.38(RST_N) ; port RST_N
SUSPEND_N: U8.101(X0D41__8D5) ; port X0D41
TCK: U8.51(TCK) ; port TCK
TDI: U8.36(TDI) ; port TDI
TMS: U8.44(TMS) ; port TMS
USB_D_N: U8.59(USB_DM) ; port USB_DM
USB_D_P: U8.60(USB_DP) ; port USB_DP
VBUS_DETECT: U8.8(X0D14__4C0) ; port X0D14
WCLK_IN: U8.99(X0D39__1P) ; port X0D39
X0D12: U8.46(X0D12__1E) ; port X0D12
X0D13: U8.47(X0D13__1F) ; port X0D13
X0D22: U8.48(X0D22__1G) ; port X0D22
X0D23: U8.49(X0D23__1H) ; port X0D23
X0D24: U8.86(X0D24__1I/XL3_IN4) ; port X0D24
X0D25: U8.87(X0D25__1J/XL3_IN3) ; port X0D25
X0D34: U8.125(X0D34__1K) ; port X0D34
X0D40: U8.98(X0D40__8D4) ; port X0D40
X1D09: U8.21(X1D09__4A3) ; port X1D09
X1D12: U8.53(X1D12__1E) ; port X1D12
X1D15: U8.65(X1D15__4C1/XL0_IN2) ; port X1D15
X1D20: U8.71(X1D20__4C2/XL0_OUT2) ; port X1D20
X1D21: U8.73(X1D21__4C3/XL0_OUT3) ; port X1D21
X1D23: U8.57(X1D23__1H) ; port X1D23
X1D26: U8.110(X1D26__4E0) ; port X1D26
X1D27: U8.111(X1D27__4E1) ; port X1D27
X1D28: U8.112(X1D28__4F0) ; port X1D28
X1D29: U8.114(X1D29__4F1) ; port X1D29
X1D30: U8.115(X1D30__4F2) ; port X1D30
X1D31: U8.116(X1D31__4F3) ; port X1D31
X1D32: U8.117(X1D32__4E2) ; port X1D32
X1D33: U8.118(X1D33__4E3) ; port X1D33
X1D43: U8.102(X1D43__8D7) ; port X1D43
X1D49: U8.75(X1D49__32A0/XL1_IN4) ; port X1D49
X1D50: U8.76(X1D50__32A1/XL1_IN3) ; port X1D50
X1D51: U8.77(X1D51__32A2/XL1_IN2) ; port X1D51
X1D52: U8.78(X1D52__32A3/XL1_IN1) ; port X1D52
X1D53: U8.79(X1D53__32A4/XL1_IN0) ; port X1D53
X1D54: U8.80(X1D54__32A5/XL1_OUT0) ; port X1D54
X1D55: U8.81(X1D55__32A6/XL1_OUT1) ; port X1D55
X1D56: U8.82(X1D56__32A7/XL1_OUT2) ; port X1D56
X1D57: U8.83(X1D57__32A8/XL1_OUT3) ; port X1D57
X1D58: U8.84(X1D58__32A9/XL1_OUT4) ; port X1D58
X_ADC_D0: U8.107(X1D24__1I) ; port X1D24
X_ADC_D1: U8.108(X1D25__1J) ; port X1D25
X_ADC_D2: U8.119(X1D34__1K) ; port X1D34
X_ADC_D3: U8.120(X1D35__1L) ; port X1D35
X_DAC_D0: U8.16(X1D39__1P) ; port X1D39
X_DAC_D1: U8.15(X1D38__1O) ; port X1D38
X_DAC_D2: U8.13(X1D37__1N) ; port X1D37
X_DAC_D3: U8.12(X1D36__1M) ; port X1D36
XL_DN0: U8.67(X1D17__4D1/XL0_IN0) ; port X1D17
XL_DN1: U8.66(X1D16__4D0/XL0_IN1) ; port X1D16
NetC6_1: C6.1 FB3.1 U8.41(PLL_AVDD)
NetC60_1: C60.1 R18.1 TP5.1 U8.34(XIN) X2.1(A)
NetC61_1: C61.1 R20.1 X2.3(B)
NetR12_1: U8.20(X1D01__1B) ; port X1D01
NetR13_1: U8.22(X1D10__1C) ; port X1D10
NetR18_2: R18.2 R20.2 TP16.1 U8.33(XOUT)
NetR39_1: U8.69(X1D18__4D2/XL0_OUT0) ; port X1D18
NetR40_1: U8.70(X1D19__4D3/XL0_OUT1) ; port X1D19
NetR118_2: U8.7(X0D11__1D) ; port X0D11
NetR122_2: U8.37(TDO) ; port TDO
NetTP2_1: TP2.1 U8.55(NC)
NetTP33_1: TP33.1 U8.40(LV_L_N)
NetTP34_1: TP34.1 U8.52(LV_R_N)
NetTP35_1: TP35.1 U8.43(LV_T_N)

Not connected (* = marked no-connect by the designer): U8 25(MIPI_DN2)* 26(MIPI_DP2)* 28(MIPI_DN1)* 29(MIPI_DP1)* 31(MIPI_DN0)* 32(MIPI_DP0)* 58(USB_ID)*

### Notes on the sheet
- Project Name
- Build
- Sheet Name
- Rev
- Date
- Sheet
- of
- (in symbol GEN-08-0039, part A) POWER
- (in symbol GEN-08-0039, part B) BANK; SYSTEM
- (in symbol GEN-08-0039, part C) VDDIOL BANK
- (in symbol GEN-08-0039, part D) VDDIOT BANK
- (in symbol GEN-08-0039, part E) VDDIOR BANK
- (in symbol GEN-08-0039, part F) USB
- (in symbol GEN-08-0039, part G) MIPI

### Library data of the parts
C6 = STD-06-0140: CHIP CAPACITOR, CERAMIC, 1.0UF, 16V, 10%, X5R, 0402; Manufacturer: Murata; Manufacturer Part Number: GRM155R61C105MA12D; Tolerance: 20%; Approx Volume Cost ($): 0.011; VALUE: 1U; Part Number: STD-06-0140; Dielectric: X5R; Rated Voltage: 16V; Web Search Link: http://www.google.com/search?q=GRM155R61C105MA12D
C7 C8 C10 C39-C44 C46-C59 = STD-06-0048: as C62 on sheet Top Level; VALUE: 100N; Part Number: STD-06-0048; Dielectric: X7R; Rated Voltage: 16V; Tolerance: 10%
  C7 C8: Web Search Link: http://www.google.com/search?q=CC0402KRX7R7BB104
C9 = GEN-03-0029: CHIP CAPACITOR, CERAMIC, 2.2UF, 6.3V, 10%, X5R, 0402; Manufacturer: AVX; Manufacturer Part Number: 04026D225KAT2A; Approx Volume Cost ($): 0.015; VALUE: 2U2; Part Number: GEN-03-0029; Dielectric: X5R; Rated Voltage: 6.3V; Tolerance: 10%
C60 C61 = STD-06-0016: CHIP CAPACITOR, CERAMIC, 18PF, 50V, 5%, NP0, 0402; Manufacturer: Yageo; Manufacturer Part Number: CC0402JRNPO9BN180; Approx Volume Cost ($): 0.003; VALUE: 18P; Part Number: STD-06-0016; Dielectric: NP0; Rated Voltage: 50V; Tolerance: 5%; Web Search Link: http://www.google.com/search?q=CC0402JRNPO9BN180
FB3 = GEN-04-0019: Ferrite Bead, 1000R AT 100MHz, For Signal Lines, 0402, 0.25A; Manufacturer: Murata; Manufacturer Part Number: BLM15HD102SN1; Max DCR: 1.25R; Approx Volume Cost ($): 0.018; VALUE: 1000R; Part Number: GEN-04-0019; Web Search Link: http://www.google.com/search?q=BLM15HD102SN1
R18 = STD-02-0134: CHIP RESISTOR, 1.0M OHM, 0.1W, 5%, 0603; Manufacturer: Yageo; Manufacturer Part Number: RC0603JR-071ML; Max Voltage: 50V; Max Power: 100mW; Temperature Coefficient: ±100ppm/°C; Approx Volume Cost ($): 0.002; VALUE: 1M; Part Number: STD-02-0134; Tolerance: 5%
R20 = STD-02-0058: CHIP RESISTOR, 680 OHM, 0.1W, 1%, 0603; Manufacturer: Yageo; Manufacturer Part Number: RC0603FR-07680RL; Max Voltage: 50V; Max Power: 100mW; Temperature Coefficient: ±100ppm/°C; Approx Volume Cost ($): 0.002; VALUE: 680R; Part Number: STD-02-0058; Tolerance: 1%
TP2 TP5 TP16 TP33-TP35 = GEN-24-0019: Testpoint, SMD, 0.9mm; Manufacturer: NA; VALUE: TESTPOINT; Part Number: GEN-24-0019; Manufacturer Part Number: NA; Approx Volume Cost ($): NA
U8 = GEN-08-0039: Processor, xcore.ai, 2400MIPS, 128TQFP; Manufacturer: XMOS; Approx Volume Cost ($): 5; VALUE: XU316-1024-TQ128-C24; Part Number: GEN-08-0039; Manufacturer Part Number: XU316-1024-TQ128-C24; Web Search Link: http://www.google.com/search?q=XU316-1024-TQ128
X2 = GEN-15-0032: Crystal, 24MHz, Freq Tol. ±30ppm, Freq Stab. ±30ppm, CL 12pF, 3.2x2.5mm SMD; Manufacturer: Seiko Epson; Manufacturer Part Number: FA-238 24.0000MD30X-W; Approx Volume Cost ($): 0.15; VALUE: FA-238; Part Number: GEN-15-0032; Web Search Link: http://www.google.com/search?q=FA-238 24.0000MD30X-W

## Sheet Power.SchDoc: xcore.ai Multi Channel Audio
size 408 x 287 mm; DocumentNumber: 8; Revision: 1V1; SheetNumber: 8; SheetTotal: 8
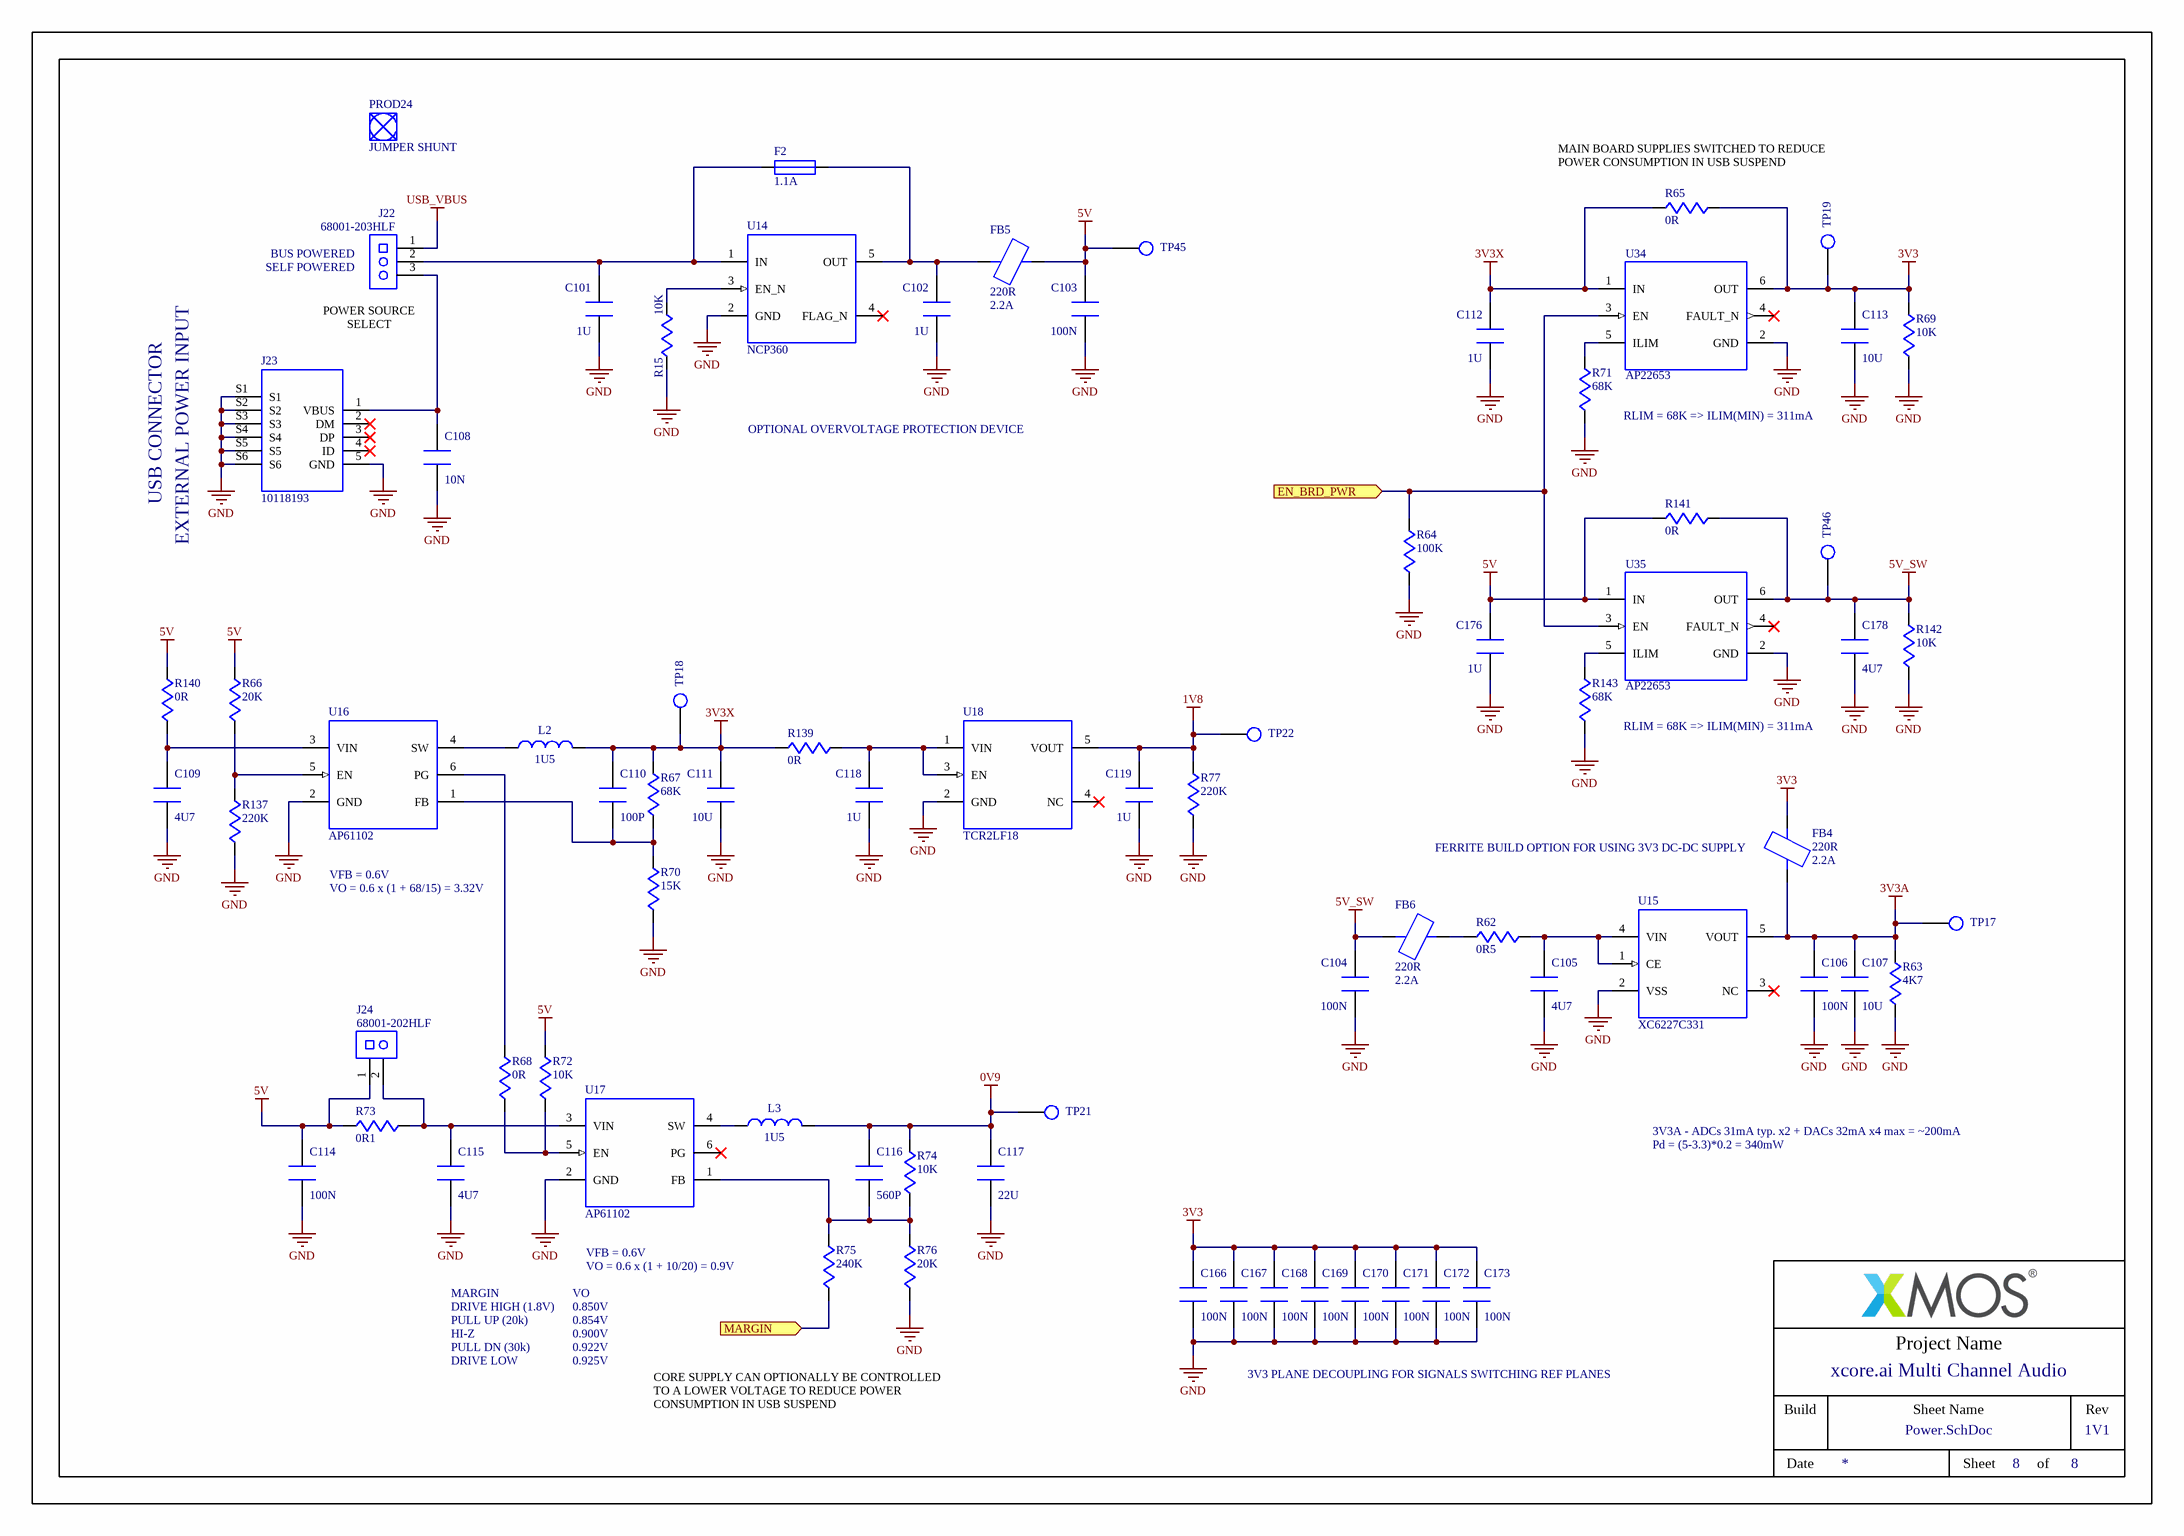
[diagram p3: Power.SchDoc]

### Parts
C101  1U  [CAPC1005X55N]
C102  1U  [CAPC1005X55N]
C103  100N  [CAPC1005X55N]
C104  100N  [CAPC1005X55N]
C105  4U7  [CAPC1608X90N]
C106  100N  [CAPC1005X55N]
C107  10U  [CAPC1608X90N]
C108  10N  [CAPC1005X55N]
C109  4U7  [CAPC1608X90N]
C110  100P  [CAPC1005X55N]
C111  10U  [CAPC1608X90N]
C112  1U  [CAPC1005X55N]
C113  10U  [CAPC1608X90N]
C114  100N  [CAPC1005X55N]
C115  4U7  [CAPC1608X90N]
C116  560P  [CAPC1005X55N]
C117  22U  [CAPC1608X90N]
C118  1U  [CAPC1005X55N]
C119  1U  [CAPC1005X55N]
C166  100N  [CAPC1005X55N]
C167  100N  [CAPC1005X55N]
C168  100N  [CAPC1005X55N]
C169  100N  [CAPC1005X55N]
C170  100N  [CAPC1005X55N]
C171  100N  [CAPC1005X55N]
C172  100N  [CAPC1005X55N]
C173  100N  [CAPC1005X55N]
C176  1U  [CAPC1005X55N]
C178  4U7  [CAPC1608X90N]
F2  1.1A  [FUSC4632X150N]
FB4  220R  Rated Current: 2.2A  [INDC1608X95N]
FB5  220R  Rated Current: 2.2A  [INDC1608X95N]
FB6  220R  Rated Current: 2.2A  [INDC1608X95N]
J22  68001-203HLF  [HDR_FCI_68001_203]
J23  10118193  [CON_FCI_10118193]
J24  68001-202HLF  [HDR_FCI_68001_202]
L2  1U5  [INDC2520X120N]
L3  1U5  [INDC2520X120N]
PROD24  JUMPER SHUNT  (mechanical)
R15  10K  [RESC1608X55N]
R62  0R5  [RESC1608X55N]
R63  4K7  [RESC1608X55N]
R64  100K  [RESC1608X55N]
R65  0R  [RESC1608X55N]
R66  20K  [RESC1608X55N]
R67  68K  [RESC1608X55N]
R68  0R  [RESC1608X55N]
R69  10K  [RESC1608X55N]
R70  15K  [RESC1608X55N]
R71  68K  [RESC1608X55N]
R72  10K  [RESC1608X55N]
R73  0R1  [RESC1608X55N]
R74  10K  [RESC1608X55N]
R75  240K  [RESC1608X55N]
R76  20K  [RESC1608X55N]
R77  220K  [RESC1608X55N]
R137  220K  [RESC1608X55N]
R139  0R  [RESC1608X55N]
R140  0R  [RESC1608X55N]
R141  0R  [RESC1608X55N]
R142  10K  [RESC1608X55N]
R143  68K  [RESC1608X55N]
TP17  TESTPOINT  [TESTPOINT_THRU]  (value not drawn)  (no BOM)
TP18  TESTPOINT  [TESTPOINT_THRU]  (value not drawn)  (no BOM)
TP19  TESTPOINT  [TESTPOINT_THRU]  (value not drawn)  (no BOM)
TP21  TESTPOINT  [TESTPOINT_THRU]  (value not drawn)  (no BOM)
TP22  TESTPOINT  [TESTPOINT_THRU]  (value not drawn)  (no BOM)
TP45  TESTPOINT  [TESTPOINT_THRU]  (value not drawn)  (no BOM)
TP46  TESTPOINT  [TESTPOINT_THRU]  (value not drawn)  (no BOM)
U14  NCP360  [SOT23-5P95_275X110L40X37N]
U15  XC6227C331  [TOREX_SOT_89_5]
U16  AP61102  [ICSOFL6P50_160X160X60L30X21N]
U17  AP61102  [ICSOFL6P50_160X160X60L30X21N]
U18  TCR2LF18  [SOT23-5P95_275X110L40X37N]
U34  AP22653  [SOT95P280X145-6N]
U35  AP22653  [SOT95P280X145-6N]

### Ports
EN_BRD_PWR (in), MARGIN (in)

### Nets
0V9: C116.1 C117.1 L3.2 R74.2 TP21.1
1V8: C119.1 R77.2 TP22.1 U18.5(VOUT)
3V3: C113.1 C166.1 C167.1 C168.1 C169.1 C170.1 C171.1 C172.1 C173.1 FB4.2 R65.2 R69.2 TP19.1 U34.6(OUT)
3V3A: C106.1 C107.1 FB4.1 R63.2 TP17.1 U15.5(VOUT)
3V3X: C110.1 C111.1 C112.1 L2.2 R65.1 R67.2 R139.1 TP18.1 U34.1(IN)
5V: C103.1 C114.1 C176.1 FB5.2 J24.1 R66.2 R72.2 R73.1 R140.2 R141.1 TP45.1 U35.1(IN)
5V_SW: C104.1 C178.1 FB6.1 R141.2 R142.2 TP46.1 U35.6(OUT)
GND: C101.2 C102.2 C103.2 C104.2 C105.2 C106.2 C107.2 C108.2 C109.2 C111.2 C112.2 C113.2 C114.2 C115.2 C117.2 C118.2 C119.2 C166.2 C167.2 C168.2 C169.2 C170.2 C171.2 C172.2 C173.2 C176.2 C178.2 J23.5(GND) J23.S1 J23.S2 J23.S3 J23.S4 J23.S5 J23.S6 R15.1 R63.1 R64.1 R69.1 R70.1 R71.1 R76.1 R77.1 R137.1 R142.1 R143.1 U14.2(GND) U15.2(VSS) U16.2(GND) U17.2(GND) U18.2(GND) U34.2(GND) U35.2(GND)
USB_VBUS: J22.1
SUSPEND_N: R64.2 U34.3(EN) U35.3(EN) ; port EN_BRD_PWR
X0D22: R75.1 ; port MARGIN
NetC101_1: C101.1 F2.1(T1) J22.2 U14.1(IN)
NetC102_1: C102.1 F2.2(T2) FB5.1 U14.5(OUT)
NetC105_1: C105.1 R62.2 U15.1(CE) U15.4(VIN)
NetC108_1: C108.1 J22.3 J23.1(VBUS)
NetC109_1: C109.1 R140.1 U16.3(VIN)
NetC110_2: C110.2 R67.1 R70.2 U16.1(FB)
NetC115_1: C115.1 J24.2 R73.2 U17.3(VIN)
NetC116_2: C116.2 R74.1 R75.2 R76.2 U17.1(FB)
NetC118_1: C118.1 R139.2 U18.1(VIN) U18.3(EN)
NetFB6_2: FB6.2 R62.1
NetL2_1: L2.1 U16.4(SW)
NetL3_1: L3.1 U17.4(SW)
NetR15_2: R15.2 U14.3(EN_N)
NetR66_1: R66.1 R137.2 U16.5(EN)
NetR68_1: R68.1 R72.1 U17.5(EN)
NetR68_2: R68.2 U16.6(PG)
NetR71_2: R71.2 U34.5(ILIM)
NetR143_2: R143.2 U35.5(ILIM)

Not connected (* = marked no-connect by the designer): J23 2(DM)* 3(DP)* 4(ID)*; U14 4(FLAG_N)*; U15 3(NC)*; U17 6(PG)*; U18 4(NC)*; U34 4(FAULT_N)*; U35 4(FAULT_N)*

### Notes on the sheet
- (near R65) MAIN BOARD SUPPLIES SWITCHED TO REDUCE POWER CONSUMPTION IN USB SUSPEND
- (near J22) BUS POWERED
- (near J22) SELF POWERED
- (near J22) POWER SOURCE
  SELECT
- OPTIONAL OVERVOLTAGE PROTECTION DEVICE
- (near R71) Text
- (near R71) RLIM = 68K => ILIM(MIN) = 311mA
- USB CONNECTOR
- EXTERNAL POWER INPUT
- (near R143) RLIM = 68K => ILIM(MIN) = 311mA
- VFB = 0.6V
- (near FB4) FERRITE BUILD OPTION FOR USING 3V3 DC-DC SUPPLY
- VO = 0.6 x (1 + 68/15) = 3.32V
- 3V3A - ADCs 31mA typ. x2 + DACs 32mA x4 max = ~200mA
- Pd = (5-3.3)*0.2 = 340mW
- VO = 0.6 x (1 + 10/20) = 0.9V
- MARGIN
- HI-Z
- PULL DN (30k)
- PULL UP (20k)
- DRIVE HIGH (1.8V)
- VO
- 0.900V
- 0.922V
- 0.854V
- 0.850V
- DRIVE LOW
- 0.925V
- CORE SUPPLY CAN OPTIONALLY BE CONTROLLED TO A LOWER VOLTAGE TO REDUCE POWER CONSUMPTION IN USB SUSPEND
- 3V3 PLANE DECOUPLING FOR SIGNALS SWITCHING REF PLANES
- Project Name
- Build
- Sheet Name
- Rev
- Date
- Sheet
- of

### Library data of the parts
C101 C102 C112 C118 C119 C176 = STD-06-0140: as C6 on sheet XMOS; VALUE: 1U; Part Number: STD-06-0140; Dielectric: X5R; Rated Voltage: 16V; Web Search Link: http://www.google.com/search?q=GRM155R61C105MA12D
C103 C104 C106 C114 C166-C173 = STD-06-0048: as C62 on sheet Top Level; VALUE: 100N; Part Number: STD-06-0048; Dielectric: X7R; Rated Voltage: 16V; Tolerance: 10%; Web Search Link: http://www.google.com/search?q=CC0402KRX7R7BB104
C105 C109 C115 C178 = STD-06-0151: CHIP CAPACITOR, CERAMIC, 4.7UF, 16V, 10%, X5R, 0603; Manufacturer: Murata; Manufacturer Part Number: GRM188R61C475KE11D; Approx Volume Cost ($): 0.084; VALUE: 4U7; Part Number: STD-06-0151; Dielectric: X5R; Rated Voltage: 16V; Tolerance: 10%; Web Search Link: http://www.google.com/search?q=GRM188R61C475KE11D
C107 C111 C113 = GEN-03-0043: CHIP CAPACITOR, CERAMIC, 10UF, 10V, 20%, X5R, 0603; Manufacturer: Murata; Manufacturer Part Number: GRM188R61A106ME69; Approx Volume Cost ($): 0.03; VALUE: 10U; Part Number: GEN-03-0043; Dielectric: X5R; Rated Voltage: 10V; Tolerance: 20%; Web Search Link: http://www.google.com/search?q=GRM188R61A106ME69
C108 = STD-06-0042: as C63 on sheet Top Level; VALUE: 10N; Part Number: STD-06-0042; Dielectric: X7R; Rated Voltage: 50V; Tolerance: 10%; Web Search Link: http://www.google.com/search?q=CC0402KRX7R9BB103
C110 = STD-06-0030: CHIP CAPACITOR, CERAMIC, 100PF, 50V, 10%, X7R, 0402; Manufacturer: Yageo; Manufacturer Part Number: CC0402KRX7R9BB101; Approx Volume Cost ($): 0.002; VALUE: 100P; Part Number: STD-06-0030; Dielectric: X7R; Rated Voltage: 50V; Tolerance: 10%; Web Search Link: http://www.google.com/search?q=CC0402KRX7R9BB101
C116 = STD-06-0147: CHIP CAPACITOR, CERAMIC, 560PF, 50V, 5%, NP0, 0402; Manufacturer: Yageo; Manufacturer Part Number: CC0402JRNPO9BN561; Approx Volume Cost ($): 0.017; VALUE: 560P; Part Number: STD-06-0147; Dielectric: NP0; Rated Voltage: 50V; Tolerance: 5%; Web Search Link: http://www.google.com/search?q=CC0402JRNPO9BN561
C117 = GEN-03-0046: CHIP CAPACITOR, CERAMIC, 22UF, 6.3V, 20%, X5R, 0603; Manufacturer: Murata; Manufacturer Part Number: GRM188R60J226MEA0; Approx Volume Cost ($): 0.04; VALUE: 22U; Part Number: GEN-03-0046; Dielectric: X5R; Rated Voltage: 6.3V; Tolerance: 20%; Web Search Link: http://www.google.com/search?q=GRM188R60J226MEA0
F2 = GEN-21-0008: Polyswitch Resettable Fuse, miniSMDC Series, 1.1A, 24V, SMD; Manufacturer: Littelfuse; Manufacturer Part Number: MINISMDC110F/24; Max Resistance (R1max): 0.18R; Approx Volume Cost ($): 0.25; VALUE: 1.1A; Part Number: GEN-21-0008; Max Voltage: 24V; Web Search Link: http://www.google.com/search?q=MINISMDC110F/24
FB4-FB6 = GEN-04-0018: Ferrite Bead, 220R AT 100MHz, For Power Lines, AEC-Q200, 0603, 2.2A; Manufacturer: Murata; Manufacturer Part Number: BLM18KG221BH1; Max DCR: 0.05R; Approx Volume Cost ($): 0.022; VALUE: 220R; Part Number: GEN-04-0018; Web Search Link: http://www.google.com/search?q=BLM18KG221BH1
J22 = GEN-01-0023: Pin Header, Male, Vertical, Through Hole, 3 Way, 1x3, 0.1 Inch Pitch; Manufacturer: FCI; Approx Volume Cost ($): 0.08; VALUE: 68001-203HLF; Part Number: GEN-01-0023; Manufacturer Part Number: 68001-203HLF; Web Search Link: http://www.google.com/search?q=68001-203HLF
J23 = GEN-01-0020: as J16 on sheet Top Level; VALUE: 10118193; Part Number: GEN-01-0020; Web Search Link: http://www.google.com/search?q=10118193-0001LF
J24 = GEN-01-0011: as J14 on sheet Top Level; VALUE: 68001-202HLF; Part Number: GEN-01-0011; Manufacturer Part Number: 68001-202HLF; Web Search Link: http://www.google.com/search?q=68001-202HLF
L2 L3 = GEN-05-0025: Power Inductor, 1.5uH, 2.6A, 65mR DCR, 2.5x2.0x1.2mm, SMD; Manufacturer: Taiyo Yuden; Manufacturer Part Number: MAMK2520H1R5M; Tolerance: 20%; Max DC Resistance: 0.065R; Rated Current (Saturation): 3.3A; Approx Volume Cost ($): 0.096; VALUE: 1U5; Part Number: GEN-05-0025; Rated Current (Temp Rise): 2.6A; Web Search Link: http://www.google.com/search?q=MAMK2520H1R5M
PROD24 = GEN-23-0011: as PROD1 on sheet Top Level; VALUE: JUMPER SHUNT; Part Number: GEN-23-0011; Web Search Link: http://www.google.com/search?q=QPC02SXGN-RC
R15 R69 R72 R74 R142 = STD-02-0086: as R23 on sheet Top Level; VALUE: 10K; Part Number: STD-02-0086; Tolerance: 1%; Web Search Link: http://www.google.com/search?q=RC0603FR-0710KL
R62 = GEN-02-0023: CHIP RESISTOR, 0.5 OHM, 100mW, 1%, 0603; Manufacturer: Yageo; Manufacturer Part Number: RL0603FR-070R5L; Max Voltage: 50V; Max Power: 0.1W; Temperature Coefficient: ±800ppm/°C; Approx Volume Cost ($): 0.06; VALUE: 0R5; Part Number: GEN-02-0023; Tolerance: 1%; Web Search Link: http://www.google.com/search?q=RL0603FR-070R5L
R63 = STD-02-0078: as R41 on sheet Top Level; VALUE: 4K7; Part Number: STD-02-0078; Tolerance: 1%; Web Search Link: http://www.google.com/search?q=RC0603FR-074K7L
R64 = STD-02-0110: as R45 on sheet Top Level; VALUE: 100K; Part Number: STD-02-0110; Tolerance: 1%; Web Search Link: http://www.google.com/search?q=RC0603FR-07100KL
R65 R68 R139-R141 = STD-02-0001: as R118 on sheet Top Level; VALUE: 0R; Part Number: STD-02-0001; Max Power: NA; Temperature Coefficient: NA; Web Search Link: http://www.google.com/search?q=RC0603JR-070RL
R66 R76 = STD-02-0093: CHIP RESISTOR, 20K OHM, 0.1W, 1%, 0603; Manufacturer: Yageo; Manufacturer Part Number: RC0603FR-0720KL; Max Voltage: 50V; Max Power: 100mW; Temperature Coefficient: ±100ppm/°C; Approx Volume Cost ($): 0.002; VALUE: 20K; Part Number: STD-02-0093; Tolerance: 1%; Web Search Link: http://www.google.com/search?q=RC0603FR-0720KL
R67 R71 R143 = STD-02-0106: CHIP RESISTOR, 68K OHM, 0.1W, 1%, 0603; Manufacturer: Yageo; Manufacturer Part Number: RC0603FR-0768KL; Max Voltage: 50V; Max Power: 100mW; Temperature Coefficient: ±100ppm/°C; Approx Volume Cost ($): 0.002; VALUE: 68K; Part Number: STD-02-0106; Tolerance: 1%; Web Search Link: http://www.google.com/search?q=RC0603FR-0768KL
R70 = STD-02-0090: CHIP RESISTOR, 15K OHM, 0.1W, 1%, 0603; Manufacturer: Yageo; Manufacturer Part Number: RC0603FR-0715KL; Max Voltage: 50V; Max Power: 100mW; Temperature Coefficient: ±100ppm/°C; Approx Volume Cost ($): 0.002; VALUE: 15K; Part Number: STD-02-0090; Tolerance: 1%; Web Search Link: http://www.google.com/search?q=RC0603FR-0715KL
R73 = GEN-02-0024: CHIP RESISTOR, 0.1 OHM, 100mW, 1%, 0603; Manufacturer: Yageo; Manufacturer Part Number: RL0603FR-070R1L; Max Voltage: 50V; Max Power: 0.1W; Temperature Coefficient: ±800ppm/°C; Approx Volume Cost ($): 0.06; VALUE: 0R1; Part Number: GEN-02-0024; Tolerance: 1%; Web Search Link: http://www.google.com/search?q=RL0603FR-070R1L
R75 = STD-02-0119: CHIP RESISTOR, 240K OHM, 0.1W, 1%, 0603; Manufacturer: Yageo; Manufacturer Part Number: RC0603FR-07240KL; Max Voltage: 50V; Max Power: 100mW; Temperature Coefficient: ±100ppm/°C; Approx Volume Cost ($): 0.002; VALUE: 240K; Part Number: STD-02-0119; Tolerance: 1%; Web Search Link: http://www.google.com/search?q=RC0603FR-07240KL
R77 R137 = STD-02-0118: CHIP RESISTOR, 220K OHM, 0.1W, 1%, 0603; Manufacturer: Yageo; Manufacturer Part Number: RC0603FR-07220KL; Max Voltage: 50V; Max Power: 100mW; Temperature Coefficient: ±100ppm/°C; Approx Volume Cost ($): 0.002; VALUE: 220K; Part Number: STD-02-0118; Tolerance: 1%; Web Search Link: http://www.google.com/search?q=RC0603FR-07220KL
TP17-TP19 TP21 TP22 TP45 TP46 = GEN-24-0002: Testpoint, Through Hole; Manufacturer: NA; VALUE: TESTPOINT; Part Number: GEN-24-0002; Manufacturer Part Number: NA; Approx Volume Cost ($): NA
U14 = GEN-14-0068: USB Positive Overvoltage Protection Controller, Internal P-FET, OVLO 6.25V, TSOT23-5; Manufacturer: ON Semiconductor; Manufacturer Part Number: NCP360SNAET1G; Op Temp Range: TA = -40 to 85; Approx Volume Cost ($): 0.25; VALUE: NCP360; Part Number: GEN-14-0068; Web Search Link: http://www.google.com/search?q=NCP360SNAET1G
U15 = GEN-14-0070: Voltage Regulator, Linear, Fixed, 3V3, 700mA, w/enable, SOT89-5; Manufacturer: Torex Semiconductor; Manufacturer Part Number: XC6227C331PR-G; Op Temp Range: TA = -40 to 85; Approx Volume Cost ($): 0.35; VALUE: XC6227C331; Part Number: GEN-14-0070; Web Search Link: http://www.google.com/search?q=XC6227C331PR-G
U16 U17 = GEN-14-0064: DC-DC Synchronous Buck Converter, Adjustable, PFM/PWM, Power Good, 2.2MHz, 1A, SOT563; Manufacturer: Diodes Incorporated; Manufacturer Part Number: AP61102Z6-7; Op Temp Range: TJ = -40 to 125; Approx Volume Cost ($): 0.11; VALUE: AP61102; Part Number: GEN-14-0064; Web Search Link: http://www.google.com/search?q=AP61102Z6-7
U18 = GEN-14-0066: Voltage Regulator, Linear, Fixed, 1V8, 200mA, Low Iq=2uA, Output Active Discharge, TSOT23-5; Manufacturer: Toshiba; Manufacturer Part Number: TCR2LF18,LM; Approx Volume Cost ($): 0.08; VALUE: TCR2LF18; Part Number: GEN-14-0066; Web Search Link: http://www.google.com/search?q=TCR2LF18,LM
U34 U35 = GEN-14-0072: Precision Adjustable Current Limited Load Switch, 3.0 - 5.5V, 2.1A max, Active High Enable, SOT26; Manufacturer: Diodes Incorporated; Manufacturer Part Number: AP22653W6-7; Op Temp Range: TA = -40 to 85; Approx Volume Cost ($): 0.18; VALUE: AP22653; Part Number: GEN-14-0072; Web Search Link: http://www.google.com/search?q=AP22653W6-7